# Altium project neuro_module.PrjPcb (part 1 of 2)
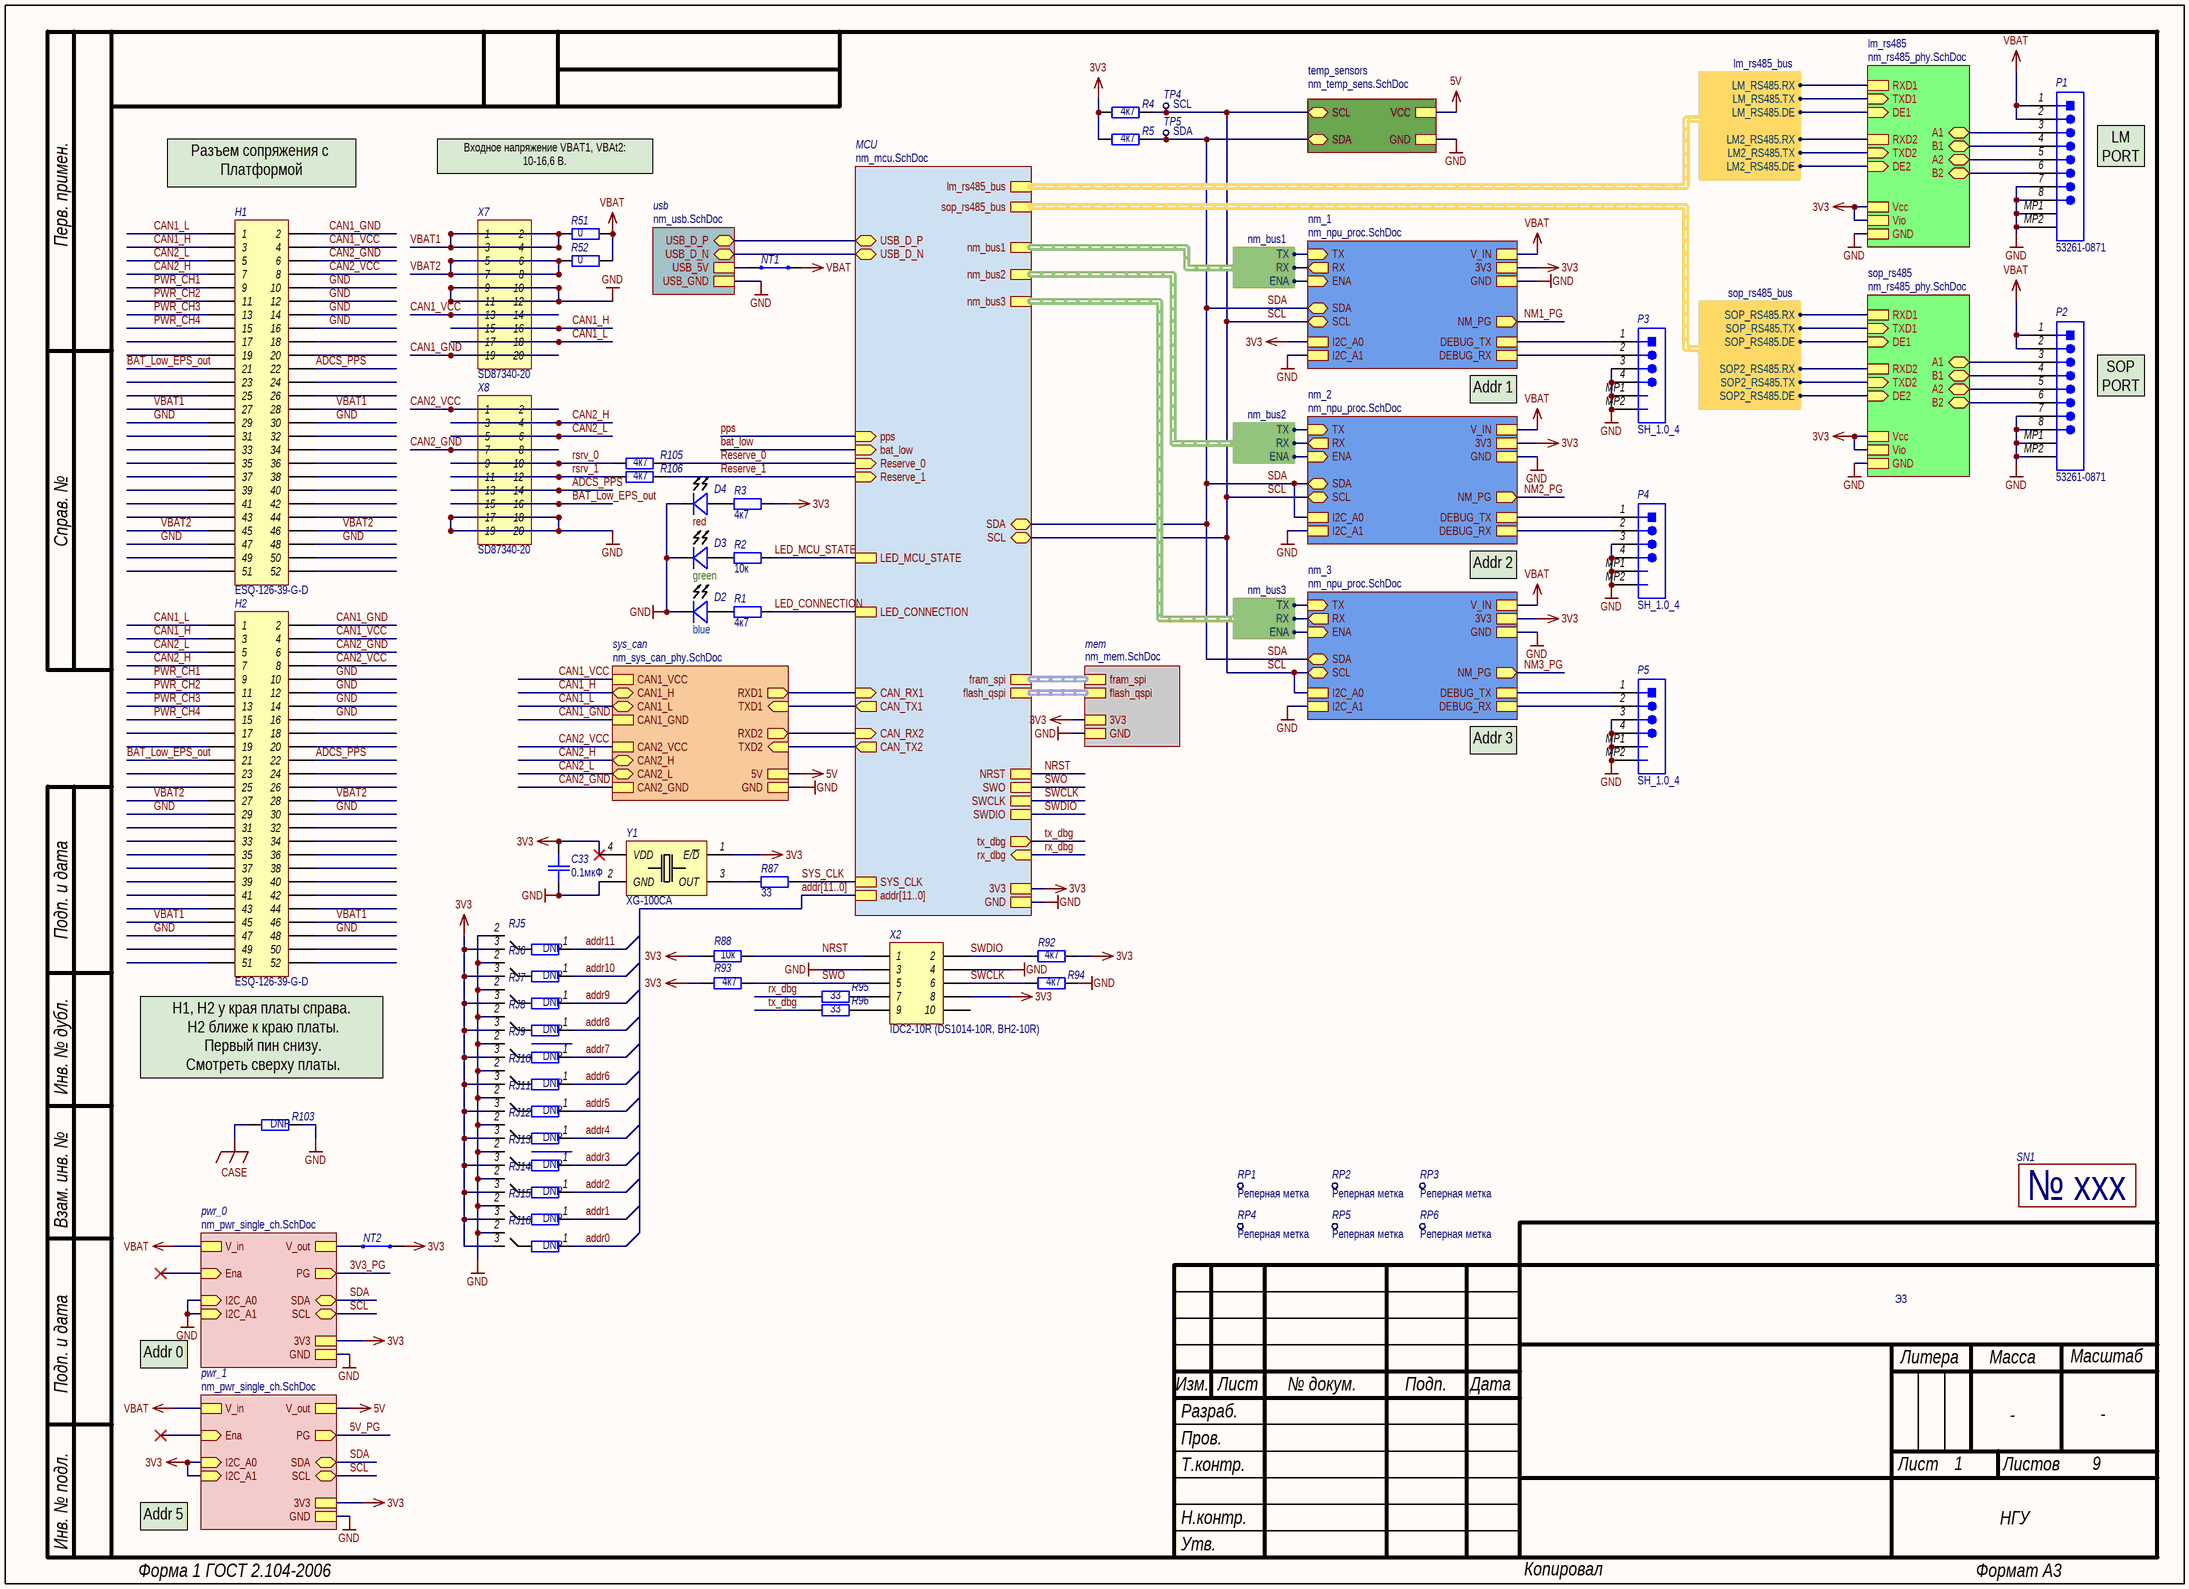
[diagram p0: nm_main.SchDoc]
GlobalOrganizationName: НГУ; GlobalProjectRevision: v1.0
9 sheets, 471 parts. Net scope: hierarchical (ports join the sheet entries above them; power ports are global).
Board file: neuro_module.PcbDoc
Sheets:
  nm_main.SchDoc
    MCU = nm_mcu.SchDoc
    usb = nm_usb.SchDoc
    pwr_0 = nm_pwr_single_ch.SchDoc
    mem = nm_mem.SchDoc
    sys_can = nm_sys_can_phy.SchDoc
    pwr_1 = nm_pwr_single_ch.SchDoc
    nm_3 = nm_npu_proc.SchDoc
      nm_pwr = nm_pwr_single_ch.SchDoc
    lm_rs485 = nm_rs485_phy.SchDoc
    nm_2 = nm_npu_proc.SchDoc
      nm_pwr = nm_pwr_single_ch.SchDoc
    nm_1 = nm_npu_proc.SchDoc
      nm_pwr = nm_pwr_single_ch.SchDoc
    sop_rs485 = nm_rs485_phy.SchDoc
    temp_sensors = nm_temp_sens.SchDoc

## Sheet nm_main.SchDoc: =GlobalProjectName
size 410 x 297 mm; Organization: НГУ; DocumentNumber: Э3; Revision: v1.0; SheetNumber: 1; SheetTotal: 9; PageSetup: Record=PageOptions|CenterHorizontal=True|CenterVertical=True|PrintScale=1.00|XCorrection=1.00|YCorrection=1.00|PrintKind=1|BorderSize=5000000|LeftOffset=0|BottomOffset=0|Orientation=2|PaperLength=1000|PaperWidth=1000|Scale=100|PaperSource=15|PrintQuality=1200|MediaType=1|DitherType=10|PaperKind=A3|PrintScaleMode=1; Weight: -; ScaleFactor: -

### Parts
C33  0.1мкФ  [SMD_C0603]
D2  value blue  [LED_0603]  (hidden comment: LED)
D3  value green  [LED_0603]  (hidden comment: LED)
D4  value red  [LED_0603]  (hidden comment: LED)
H1  ESQ-126-39-G-D  [ESQ-126-39-G-D]
H2  ESQ-126-39-G-D  [ESQ-126-39-G-D]
NT1  OSM R1-8  [NetTie_1mm]  (value not drawn)  (net tie, no BOM)
NT2  OSM R1-8  [NetTie_1mm]  (value not drawn)  (net tie, no BOM)
P1  53261-0871  [53261-0871]
P2  53261-0871  [53261-0871]
P3  SH_1.0_4  [53261-0471]
P4  SH_1.0_4  [53261-0471]
P5  SH_1.0_4  [53261-0471]
R1  4к7  [SMD_0603]
R2  10к  [SMD_0603]
R3  4к7  [SMD_0603]
R4  4к7  [SMD_0603]
R5  4к7  [SMD_0603]
R51  0  [SMD_1206]
R52  0  [SMD_1206]
R87  33  [SMD_0603]
R88  value 10к  [SMD_0603]  (hidden comment: Resistor)
R92  4к7  [SMD_0603]
R93  4к7  [SMD_0603]
R94  4к7  [SMD_0603]
R95  33  [SMD_0603]
R96  33  [SMD_0603]
R103  DNP  [SMD_0805]
R105  4к7  [SMD_0603]
R106  4к7  [SMD_0603]
RJ5  value DNP  [SMD_JMP_0402]  (hidden comment: OSM R1-8)
RJ6  value DNP  [SMD_JMP_0402]  (hidden comment: OSM R1-8)
RJ7  value DNP  [SMD_JMP_0402]  (hidden comment: OSM R1-8)
RJ8  value DNP  [SMD_JMP_0402]  (hidden comment: OSM R1-8)
RJ9  value DNP  [SMD_JMP_0402]  (hidden comment: OSM R1-8)
RJ10  value DNP  [SMD_JMP_0402]  (hidden comment: OSM R1-8)
RJ11  value DNP  [SMD_JMP_0402]  (hidden comment: OSM R1-8)
RJ12  value DNP  [SMD_JMP_0402]  (hidden comment: OSM R1-8)
RJ13  value DNP  [SMD_JMP_0402]  (hidden comment: OSM R1-8)
RJ14  value DNP  [SMD_JMP_0402]  (hidden comment: OSM R1-8)
RJ15  value DNP  [SMD_JMP_0402]  (hidden comment: OSM R1-8)
RJ16  value DNP  [SMD_JMP_0402]  (hidden comment: OSM R1-8)
RP1  Наименование: Реперная метка  [ReperPoint]  (hidden comment: RP)  (no BOM)
RP2  Наименование: Реперная метка  [ReperPoint]  (hidden comment: RP)  (no BOM)
RP3  Наименование: Реперная метка  [ReperPoint]  (hidden comment: RP)  (no BOM)
RP4  Наименование: Реперная метка  [ReperPoint]  (hidden comment: RP)  (no BOM)
RP5  Наименование: Реперная метка  [ReperPoint]  (hidden comment: RP)  (no BOM)
RP6  Наименование: Реперная метка  [ReperPoint]  (hidden comment: RP)  (no BOM)
SN1  Место под нанесение серийного номера  [Serial_number_v2]  (value not drawn)  (graphical)
TP4  SCL  [TP_PAD_1]  (no BOM)
TP5  SDA  [TP_PAD_1]  (no BOM)
X2  Наименование: IDC2-10R (DS1014-10R, BH2-10R)  [IDC2-10R]  (hidden comment: Header 2X10)
X7  Наименование: SD87340-20  [PLD2-20_SD87340-20]  (hidden comment: Header 2X20)
X8  Наименование: SD87340-20  [PLD2-20_SD87340-20]  (hidden comment: Header 2X20)
Y1  Наименование: XG-100CA  [SMD_7050_Crystal_Oscillator]  (hidden comment: XG-1000CA)

### Sub-sheets
lm_rs485 = nm_rs485_phy.SchDoc: A1 (bidir), RXD1, TXD1 (in), DE1 (in), B1 (bidir), A2 (bidir), RXD2, TXD2 (in), DE2 (in), B2 (bidir), Vcc, Vio, GND
MCU = nm_mcu.SchDoc: SDA (bidir), SCL (bidir), USB_D_P (bidir), USB_D_N (bidir), pps (in), LED_MCU_STATE, LED_CONNECTION, bat_low (in), CAN_TX2 (out), CAN_RX2 (in), CAN_TX1 (out), CAN_RX1 (in), SYS_CLK, NRST, tx_dbg (out), SWO, rx_dbg (in), SWCLK, GND, SWDIO, 3V3, fram_spi, flash_qspi, Reserve_0 (in), Reserve_1 (in), addr[11..0], nm_bus1 (harness nm_bus1), nm_bus2 (harness nm_bus2), nm_bus3 (harness nm_bus3), lm_rs485_bus (harness lm_rs485_bus), sop_rs485_bus (harness sop_rs485_bus)
mem = nm_mem.SchDoc: 3V3, GND, fram_spi (harness fram_spi), flash_qspi (harness flash_qspi)
nm_1 = nm_npu_proc.SchDoc: GND, V_IN, TX (in), RX (out), 3V3, ENA (in), I2C_A0, I2C_A1, SCL (bidir), SDA (bidir), NM_PG (out), DEBUG_TX, DEBUG_RX
nm_2 = nm_npu_proc.SchDoc: GND, V_IN, TX (in), RX (out), 3V3, ENA (in), I2C_A0, I2C_A1, SCL (bidir), SDA (bidir), NM_PG (out), DEBUG_TX, DEBUG_RX
nm_3 = nm_npu_proc.SchDoc: GND, V_IN, TX (in), RX (out), DEBUG_TX, DEBUG_RX, 3V3, ENA (in), I2C_A0, I2C_A1, SCL (bidir), SDA (bidir), NM_PG (out)
pwr_0 = nm_pwr_single_ch.SchDoc: Ena (in), V_in, PG (out), GND, V_out, SCL (bidir), SDA (bidir), I2C_A0 (in), I2C_A1 (in), 3V3  | TP_STR: 3V3; R1_Value: 150к; R2_Value: 47к; R_efuse1_mid: 120к; R_efuse1_bot: 43к; R_efuse1_ilim: 3к3; R_pwr_led: 4к7; R_efuse2_bot: 270к; R_efuse1_top: 470к; R_efuse2_mid: 91к; R_efuse2_ilim: 1к1; R_efuse2_top: 470к; C_efuse2_dVdT: 10нФ; C_efuse2_itimer: 2.4нФ
pwr_1 = nm_pwr_single_ch.SchDoc: Ena (in), V_in, PG (out), GND, V_out, SCL (bidir), SDA (bidir), I2C_A0 (in), I2C_A1 (in), 3V3  | TP_STR: 5V0; R1_Value: 160к; R2_Value: 30к; R_efuse1_mid: 120к; R_efuse1_bot: 43к; R_efuse1_ilim: 3к3; R_pwr_led: 4к7; R_efuse2_bot: 130к; R_efuse2_mid: 62к; R_efuse2_ilim: 3к3; R_efuse1_top: 470к; R_efuse2_top: 470к; C_efuse2_dVdT: 10нФ; C_efuse2_itimer: 2.4нФ
sop_rs485 = nm_rs485_phy.SchDoc: A1 (bidir), RXD1, TXD1 (in), DE1 (in), B1 (bidir), A2 (bidir), RXD2, TXD2 (in), DE2 (in), B2 (bidir), Vcc, Vio, GND
sys_can = nm_sys_can_phy.SchDoc: CAN1_GND, CAN2_H (bidir), CAN2_L (bidir), TXD2 (in), CAN2_GND, CAN1_H (bidir), RXD2 (out), TXD1 (in), CAN2_VCC, CAN1_L (bidir), RXD1 (out), CAN1_VCC, 5V, GND
temp_sensors = nm_temp_sens.SchDoc: VCC, GND, SDA (bidir), SCL (bidir)
usb = nm_usb.SchDoc: USB_D_P (bidir), USB_D_N (bidir), USB_5V, USB_GND

### Harnesses
nm_bus1: TX, RX, ENA
nm_bus2: TX, RX, ENA
nm_bus3: TX, RX, ENA
lm_rs485_bus: LM_RS485.RX, LM_RS485.TX, LM_RS485.DE, LM2_RS485.RX, LM2_RS485.TX, LM2_RS485.DE
sop_rs485_bus: SOP_RS485.RX, SOP_RS485.TX, SOP_RS485.DE, SOP2_RS485.RX, SOP2_RS485.TX, SOP2_RS485.DE

### Nets
3V3: C33.2 NT2.2 R3.1 R4.2 R5.2 R88.1 R92.2 R93.2 RJ5.3 RJ6.3 RJ7.3 RJ8.3 RJ9.3 RJ10.3 RJ11.3 RJ12.3 RJ13.3 RJ14.3 RJ15.3 RJ16.3 X2.8 Y1.1(E/~{D}) Y1.4(VDD) ; sheet MCU/3V3, sheet pwr_0/3V3, sheet mem/3V3, sheet sys_can/5V, sheet pwr_1/V_out, sheet pwr_1/I2C_A0, sheet pwr_1/I2C_A1, sheet pwr_1/3V3, sheet nm_3/3V3, sheet lm_rs485/Vcc, sheet lm_rs485/Vio, sheet nm_2/3V3, sheet nm_1/3V3, sheet nm_1/I2C_A0, sheet sop_rs485/Vcc, sheet sop_rs485/Vio, sheet temp_sensors/VCC  [also labelled 5V]
CAN1_GND: H1.2 H2.2 X7.19 X7.20 ; sheet sys_can/CAN1_GND
CAN1_VCC: H1.4 H2.4 X7.13 X7.14 ; sheet sys_can/CAN1_VCC
CAN2_GND: H1.6 H2.6 X8.7 X8.8 ; sheet sys_can/CAN2_GND
CAN2_VCC: H1.8 H2.8 X8.1 X8.2 ; sheet sys_can/CAN2_VCC
CASE: R103.2
GND: C33.1 D2.2(K) D3.2(K) D4.2(K) H1.10 H1.12 H1.14 H1.16 H1.29 H1.30 H1.47 H1.48 H2.10 H2.12 H2.14 H2.16 H2.29 H2.30 H2.47 H2.48 P1.7 P1.8 P1.MP1 P1.MP2 P2.7 P2.8 P2.MP1 P2.MP2 P3.3 P3.4 P3.MP1 P3.MP2 P4.3 P4.4 P4.MP1 P4.MP2 P5.3 P5.4 P5.MP1 P5.MP2 R94.1 R103.1 RJ5.2 RJ6.2 RJ7.2 RJ8.2 RJ9.2 RJ10.2 RJ11.2 RJ12.2 RJ13.2 RJ14.2 RJ15.2 RJ16.2 X2.3 X2.4 X7.9 X7.10 X7.11 X7.12 X8.17 X8.18 X8.19 X8.20 Y1.2(GND) ; sheet MCU/GND, sheet usb/USB_GND, sheet pwr_0/GND, sheet pwr_0/I2C_A0, sheet pwr_0/I2C_A1, sheet mem/GND, sheet sys_can/GND, sheet pwr_1/GND, sheet nm_3/GND, sheet nm_3/I2C_A1, sheet lm_rs485/GND, sheet nm_2/GND, sheet nm_2/I2C_A1, sheet nm_1/GND, sheet nm_1/I2C_A1, sheet sop_rs485/GND, sheet temp_sensors/GND
VBAT: NT1.2 P1.1 P1.2 P2.1 P2.2 R51.2 R52.2 ; sheet pwr_0/V_in, sheet pwr_1/V_in, sheet nm_3/V_IN, sheet nm_2/V_IN, sheet nm_1/V_IN
A1: P2.3 ; sheet sop_rs485/A1
A1: P1.3 ; sheet lm_rs485/A1  [a separate net that carries the same name]
A2: P2.5 ; sheet sop_rs485/A2
A2: P1.5 ; sheet lm_rs485/A2  [a separate net that carries the same name]
ADCS_PPS: H1.22 H2.22 X8.13 X8.14
addr0: RJ16.1
addr1: RJ15.1
addr2: RJ14.1
addr3: RJ13.1
addr4: RJ12.1
addr5: RJ11.1
addr6: RJ10.1
addr7: RJ9.1
addr8: RJ8.1
addr9: RJ7.1
addr10: RJ6.1
addr11: RJ5.1
B1: P2.4 ; sheet sop_rs485/B1
B1: P1.4 ; sheet lm_rs485/B1  [a separate net that carries the same name]
B2: P2.6 ; sheet sop_rs485/B2
B2: P1.6 ; sheet lm_rs485/B2  [a separate net that carries the same name]
BAT_Low_EPS_out: H1.21 H2.21 X8.15 X8.16
CAN1_H: H1.3 H2.3 X7.15 X7.16 ; sheet sys_can/CAN1_H
CAN1_L: H1.1 H2.1 X7.17 X7.18 ; sheet sys_can/CAN1_L
CAN2_H: H1.7 H2.7 X8.3 X8.4 ; sheet sys_can/CAN2_H
CAN2_L: H1.5 H2.5 X8.5 X8.6 ; sheet sys_can/CAN2_L
CAN_RX1: sheet MCU/CAN_RX1, sheet sys_can/RXD1
CAN_RX2: sheet MCU/CAN_RX2, sheet sys_can/RXD2
CAN_TX1: sheet MCU/CAN_TX1, sheet sys_can/TXD1
CAN_TX2: sheet MCU/CAN_TX2, sheet sys_can/TXD2
DEBUG_RX: P3.2 ; sheet nm_1/DEBUG_RX
DEBUG_RX: P4.2 ; sheet nm_2/DEBUG_RX  [a separate net that carries the same name]
DEBUG_RX: P5.2 ; sheet nm_3/DEBUG_RX  [a separate net that carries the same name]
DEBUG_TX: P3.1 ; sheet nm_1/DEBUG_TX
DEBUG_TX: P4.1 ; sheet nm_2/DEBUG_TX  [a separate net that carries the same name]
DEBUG_TX: P5.1 ; sheet nm_3/DEBUG_TX  [a separate net that carries the same name]
LED_CONNECTION: R1.1 ; sheet MCU/LED_CONNECTION
LED_MCU_STATE: R2.1 ; sheet MCU/LED_MCU_STATE
lm2_rs485.DE: sheet lm_rs485/DE2, sheet MCU/lm_rs485_bus.LM2_RS485.DE
lm2_rs485.RX: sheet lm_rs485/RXD2, sheet MCU/lm_rs485_bus.LM2_RS485.RX
lm2_rs485.TX: sheet lm_rs485/TXD2, sheet MCU/lm_rs485_bus.LM2_RS485.TX
lm_rs485.DE: sheet lm_rs485/DE1, sheet MCU/lm_rs485_bus.LM_RS485.DE
lm_rs485.RX: sheet lm_rs485/RXD1, sheet MCU/lm_rs485_bus.LM_RS485.RX
lm_rs485.TX: sheet lm_rs485/TXD1, sheet MCU/lm_rs485_bus.LM_RS485.TX
nm_bus1.Ena: sheet nm_1/ENA, sheet MCU/nm_bus1.ENA
nm_bus1.RX: sheet nm_1/RX, sheet MCU/nm_bus1.RX
nm_bus1.TX: sheet nm_1/TX, sheet MCU/nm_bus1.TX
nm_bus2.Ena: sheet nm_2/ENA, sheet MCU/nm_bus2.ENA
nm_bus2.RX: sheet nm_2/RX, sheet MCU/nm_bus2.RX
nm_bus2.TX: sheet nm_2/TX, sheet MCU/nm_bus2.TX
nm_bus3.Ena: sheet nm_3/ENA, sheet MCU/nm_bus3.ENA
nm_bus3.RX: sheet nm_3/RX, sheet MCU/nm_bus3.RX
nm_bus3.TX: sheet nm_3/TX, sheet MCU/nm_bus3.TX
NRST: R88.2 X2.1 ; sheet MCU/NRST
PWR_CH1: H1.9 H2.9
PWR_CH2: H1.11 H2.11
PWR_CH3: H1.13 H2.13
PWR_CH4: H1.15 H2.15
Reserve_0: R105.1 ; sheet MCU/Reserve_0
Reserve_1: R106.1 ; sheet MCU/Reserve_1
rsrv_0: R105.2 X8.9 X8.10
rsrv_1: R106.2 X8.11 X8.12
rx_dbg: R95.1 ; sheet MCU/rx_dbg
SCL: R4.1 TP4.0(TP) ; sheet MCU/SCL, sheet pwr_0/SCL, sheet pwr_1/SCL, sheet nm_3/I2C_A0, sheet nm_3/SCL, sheet nm_2/SCL, sheet nm_1/SCL, sheet temp_sensors/SCL
SDA: R5.1 TP5.0(TP) ; sheet MCU/SDA, sheet pwr_0/SDA, sheet pwr_1/SDA, sheet nm_3/SDA, sheet nm_2/I2C_A0, sheet nm_2/SDA, sheet nm_1/SDA, sheet temp_sensors/SDA
sop2_rs485.DE: sheet sop_rs485/DE2, sheet MCU/sop_rs485_bus.SOP2_RS485.DE
sop2_rs485.RX: sheet sop_rs485/RXD2, sheet MCU/sop_rs485_bus.SOP2_RS485.RX
sop2_rs485.TX: sheet sop_rs485/TXD2, sheet MCU/sop_rs485_bus.SOP2_RS485.TX
sop_rs485.DE: sheet sop_rs485/DE1, sheet MCU/sop_rs485_bus.SOP_RS485.DE
sop_rs485.RX: sheet sop_rs485/RXD1, sheet MCU/sop_rs485_bus.SOP_RS485.RX
sop_rs485.TX: sheet sop_rs485/TXD1, sheet MCU/sop_rs485_bus.SOP_RS485.TX
SWCLK: R94.2 X2.6 ; sheet MCU/SWCLK
SWDIO: R92.1 X2.2 ; sheet MCU/SWDIO
SWO: R93.1 X2.5 ; sheet MCU/SWO
SYS_CLK: R87.2 ; sheet MCU/SYS_CLK
tx_dbg: R96.1 ; sheet MCU/tx_dbg
USB_5V: NT1.1 ; sheet usb/USB_5V
USB_D_N: sheet MCU/USB_D_N, sheet usb/USB_D_N
USB_D_P: sheet MCU/USB_D_P, sheet usb/USB_D_P
V_out: NT2.1 ; sheet pwr_0/V_out
VBAT1: H1.27 H1.28 H2.45 H2.46 R51.1 X7.1 X7.2 X7.3 X7.4
VBAT2: H1.45 H1.46 H2.27 H2.28 R52.1 X7.5 X7.6 X7.7 X7.8
NetD2_1: D2.1(A) R1.2
NetD3_1: D3.1(A) R2.2
NetD4_1: D4.1(A) R3.2
NetR87_1: R87.1 Y1.3(OUT)
NetR95_2: R95.2 X2.7
NetR96_2: R96.2 X2.9

Not connected (* = marked no-connect by the designer): H1 17 18 19 20 23 24 25 26 31 32 33 34 35 36 37 38 39 40 41 42 43 44 49 50 51 52; H2 17 18 19 20 23 24 25 26 31 32 33 34 35 36 37 38 39 40 41 42 43 44 49 50 51 52; X2 10

### Buses and harness runs
bus addr[11..0] = sheet MCU/addr[11..0]
harness sheet MCU/flash_qspi = sheet mem/flash_qspi
harness sheet MCU/fram_spi = sheet mem/fram_spi

### Notes on the sheet
- (near H1) Разъем сопряжения с
  Платформой
- Входное напряжение VBAT1, VBAt2:
  10-16,6 В.
- (near P1) LM PORT
- Addr 1
- (near P2) SOP
  PORT
- Addr 2
- Addr 3
- H1, H2 у края платы справа.
  H2 ближе к краю платы.
  Первый пин снизу.
  Смотреть сверху платы.
- Addr 0
- Addr 5
- Перв. примен.
- Справ. №
- Подп. и дата
- Инв. № дубл.
- Взам. инв. №
- Э3
- Изм.
- Разраб.
- Лист
- № докум.
- Подп.
- Дата
- Литера
- Масса
- Масштаб
- Пров.
- Т.контр.
- Листов
- Н.контр.
- Утв.
- Инв. № подл.
- Форма 1 ГОСТ 2.104-2006
- Копировал
- Формат А3
- (in symbol Serial_number) № xxx

### Library data of the parts
C33 = Capacitor: Назначение: SMD-конденсатор; Наименование: Конденсатор; Потребление, Вт: 0; Точность: %; Напряжение: В; Value: 0.1мкФ; Диэлектрик: *; Place_v1: *; Place_v2: *
D2-D4 = LED: Назначение: Светодиод; Наименование: SMD-LED; Потребление, Вт: 0,01; Place_v1: *; Place_v2: *
H1 H2 = ESQ-126-39-G-D: Elevated socket, dual-row, 26-pin per row; Назначение: Сквозной разъем, двойно, 52 контакта, шаг 2,54 мм; Потребление, Вт: 0,00; Place_v2: DNP; ComponentLink1Description: DataSheet; ComponentLink1URL: https://static.chipdip.ru/lib/071/DOC025071643.pdf; Наименование: ESQ-126-39-G-D
NT1 NT2 = NetTie: Different Nets connection; Потребление, Вт: 0,001; Value: 0; Наименование: NetTie; Назначение: NetTie; Place_v1: *; Place_v2: *
P1 P2 = PicoBlade_53261-0871: Male Header, Pitch 1.25 mm, 1 x 8 Position, Height 3.4 mm, -40 to 85 degC, RoHS, Tape and Reel; Потребление, Вт: 0.0; Назначение: Male Header, Pitch 1.25 mm, 1 x 8 Position, Height 3.4 mm, -40 to 85 degC, RoHS, Tape and Reel; ComponentLink1Description: DataSheet; ComponentLink1URL: http://www.molex.com/pdm_docs/sd/532610671_sd.pdf; Наименование: 53261-0871
P3-P5 = SH_1.0_4: JST SH1.0, 1.0 mm pitch/Disconnactable crimp style connectors; Потребление, Вт: 0.0; Назначение: JST SH1.0, 1.0 mm pitch/Disconnactable crimp style connectors; ComponentLink1Description: DataSheet; ComponentLink1URL: https://www.jst-mfg.com/product/pdf/eng/eSH.pdf; Наименование: SH_1.0_4
R1-R3 R87 R95 R96 R105 R106 = Resistor: Наименование: Резистор; Назначение: SMD-резистор; Потребление, Вт: 0,001
  R1 R3: Value: 4к7; Place_v1: *; Place_v2: *
  R2: Value: 10к; Place_v1: *; Place_v2: *
  R87 R95 R96: Value: 33; Place_v1: *; Place_v2: *
  R105 R106: Value: 4к7
R4 R5 R92-R94 R103 = Resistor: Наименование: Резистор; Назначение: SMD-резистор; Потребление, Вт: 0,001; Описание: Резистор 0603 10K ±1% 100ppm/°C; Place_v1: *; Place_v2: *
  R4 R5 R92-R94: Value: 4к7
  R103: Value: DNP
R51 = Resistor: Наименование: Резистор; Назначение: SMD-резистор; Потребление, Вт: 0,001; Place_v2: DNP; Value: 0
R52 = Resistor: Наименование: Резистор; Назначение: SMD-резистор; Потребление, Вт: 0,001; Place_v1: DNP; Value: 0
R88 = Resistor: Наименование: Резистор; Назначение: SMD-резистор; Потребление, Вт: 0,001; Точность: %; Place_v1: *; Place_v2: *
RJ5-RJ16 = Resistor_Jamper: Resistor-Jumper; Назначение: Резистор для выбора режима; Наименование: Резистор; Потребление, Вт: 0,0; Place_v1: *; Place_v2: *
RP1-RP6 = RP: Назначение: реперная метка для автоматического монтажа; Place_v1: *; Place_v2: *
SN1 = Serial_number: Потребление, Вт: 0; Назначение: Место под нанесение серийного номера; Наименование: Место под нанесение серийного номера; Place_v1: *; Place_v2: *
TP4 TP5 = TP: Наименование: Точка проверки; Назначение: Контроль параметров платы; Place_v1: *; Place_v2: *
  TP4: TP_Name: SCL
  TP5: TP_Name: SDA
X2 = Header 2X10: Header, 10-Pin, Dual row; Назначение: Header, 10-Pin, Dual row, R/A; Потребление, Вт: 0,0
X7 X8 = Header 2X20: Header, 20-Pin, Dual row; Потребление, Вт: 0,0; Place_v2: DNP; Примечание: Для монтажа из 2-х 10-pin необходимо сточить край разъема; Назначение: Header, 20-Pin, Dual row
Y1 = Crystal_Oscillator: Crystall oscillator, CMOS, 3.3V, SMD7050; Назначение: Crystall oscillator, CMOS, 3.3V, SMD7050, 10 МГц; Потребление, Вт: 0.12; ComponentLink1Description: DataSheet; ComponentLink1URL: https://ru.mouser.com/datasheet/2/137/G_1000CA_en-1003255.pdf; Place_v1: *; Place_v2: *

## Sheet nm_mcu.SchDoc: =GlobalProjectName
size 410 x 297 mm; Organization: НГУ; DocumentNumber: Э3; Revision: v1.0; SheetNumber: 2; SheetTotal: 9; PageSetup: Record=PageOptions|CenterHorizontal=True|CenterVertical=True|PrintScale=1.00|XCorrection=1.00|YCorrection=1.00|PrintKind=1|BorderSize=5000000|LeftOffset=0|BottomOffset=0|Orientation=2|PaperLength=1000|PaperWidth=1000|Scale=100|PaperSource=15|PrintQuality=1200|MediaType=1|DitherType=10|PaperKind=A3|PrintScaleMode=1; Weight: -; ScaleFactor: -
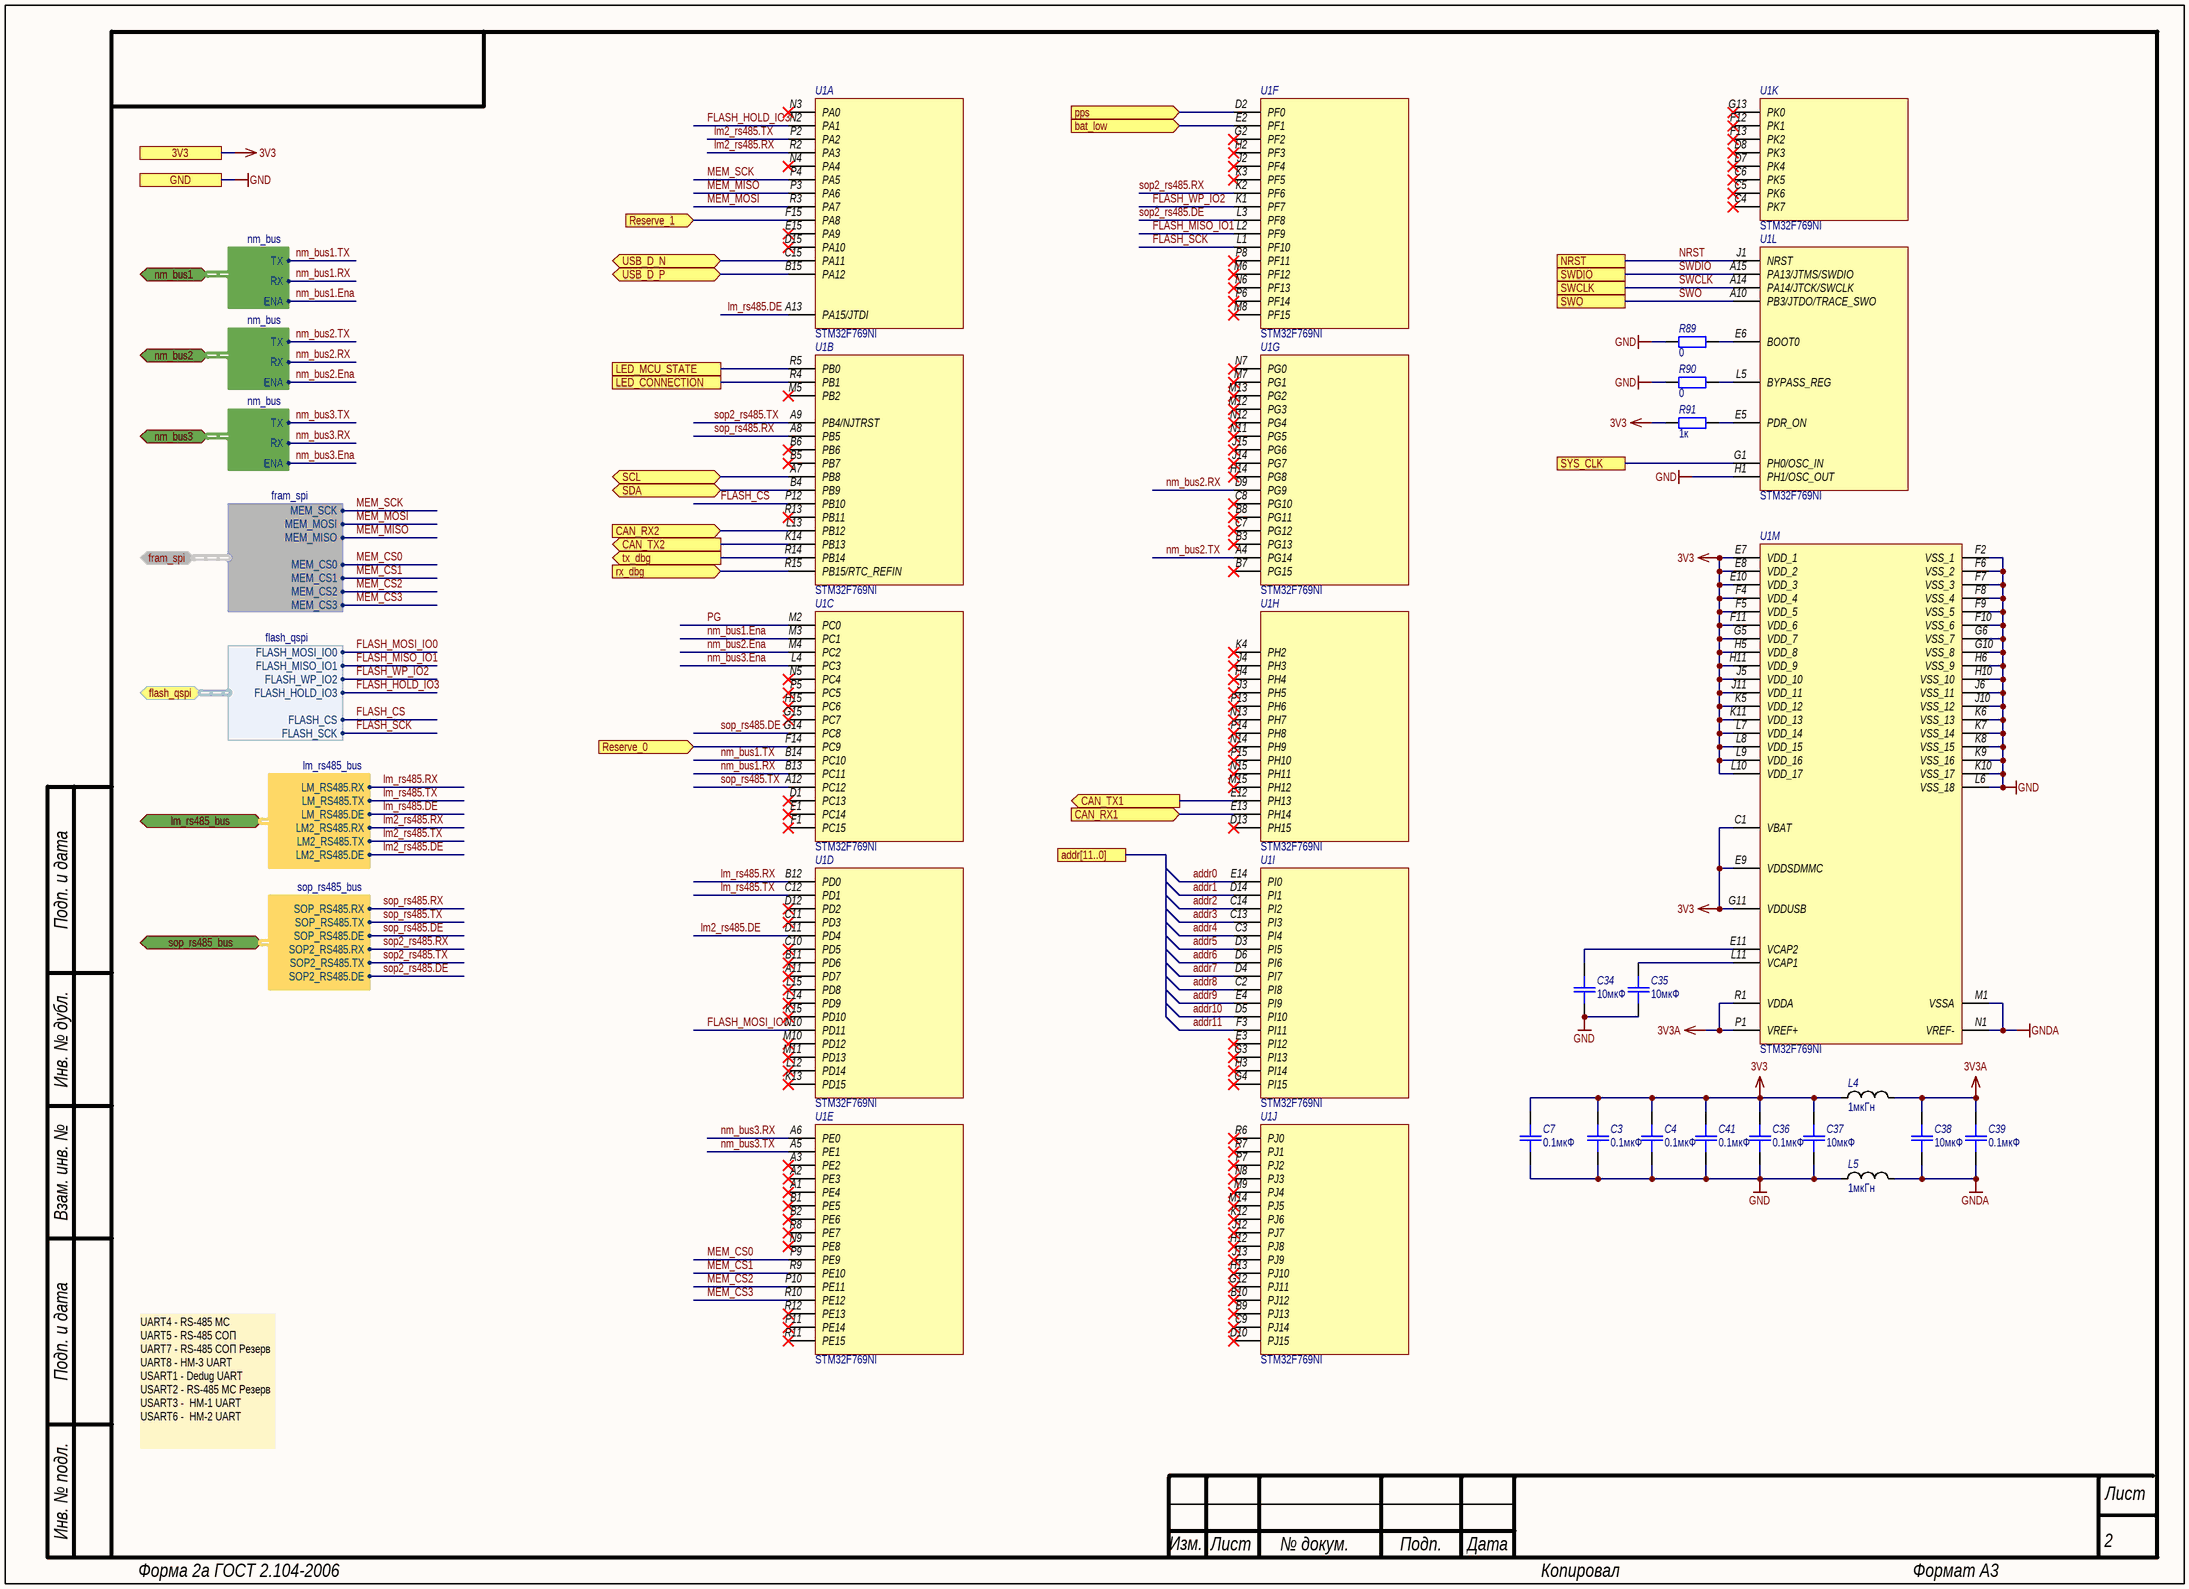
[diagram p1: nm_mcu.SchDoc]

### Parts
C3  0.1мкФ  [SMD_C0603]
C4  0.1мкФ  [SMD_C0603]
C7  0.1мкФ  [SMD_C0603]
C34  value 10мкФ  [SMD_C0603]  (hidden comment: Capacitor)
C35  value 10мкФ  [SMD_C0603]  (hidden comment: Capacitor)
C36  0.1мкФ  [SMD_C0603]
C37  10мкФ  [SMD_C0603]
C38  10мкФ  [SMD_C0603]
C39  0.1мкФ  [SMD_C0603]
C41  0.1мкФ  [SMD_C0603]
L4  1мкГн  [SMD_0805]
L5  1мкГн  [SMD_0805]
R89  value 0  [SMD_0603]  (hidden comment: Resistor)
R90  value 0  [SMD_0603]  (hidden comment: Resistor)
R91  value 1к  [SMD_0603]  (hidden comment: Resistor)
U1  STM32F769NI  [BGA216C80P15X15_1300X1300X110]  (parts A,B,C,D,E,F,G,H,I,J,K,L,M of 13)

### Ports
3V3, addr[11..0], bat_low (in), CAN_RX1 (in), CAN_RX2 (in), CAN_TX1 (out), CAN_TX2 (out), flash_qspi (bidir, harness flash_qspi), fram_spi (bidir, harness fram_spi), GND, LED_CONNECTION, LED_MCU_STATE, lm_rs485_bus (bidir, harness lm_rs485_bus), nm_bus1 (bidir, harness nm_bus), nm_bus2 (bidir, harness nm_bus), nm_bus3 (bidir, harness nm_bus), NRST, pps (in), Reserve_0 (in), Reserve_1 (in), rx_dbg (in), SCL (bidir), SDA (bidir), sop_rs485_bus (bidir, harness sop_rs485_bus), SWCLK, SWDIO, SWO, SYS_CLK, tx_dbg (out), USB_D_N (bidir), USB_D_P (bidir)

### Harnesses
fram_spi: MEM_SCK, MEM_MOSI, MEM_MISO, MEM_CS0, MEM_CS1, MEM_CS2, MEM_CS3
flash_qspi: FLASH_MOSI_IO0, FLASH_MISO_IO1, FLASH_WP_IO2, FLASH_HOLD_IO3, FLASH_CS, FLASH_SCK
nm_bus: TX, RX, ENA
lm_rs485_bus: LM_RS485.RX, LM_RS485.TX, LM_RS485.DE, LM2_RS485.RX, LM2_RS485.TX, LM2_RS485.DE
sop_rs485_bus: SOP_RS485.RX, SOP_RS485.TX, SOP_RS485.DE, SOP2_RS485.RX, SOP2_RS485.TX, SOP2_RS485.DE

### Nets
3V3: C3.2 C4.2 C7.2 C36.2 C37.2 C41.2 L4.1 R91.1 U1.C1(VBAT) U1.E7(VDD_1) U1.E8(VDD_2) U1.E9(VDDSDMMC) U1.E10(VDD_3) U1.F4(VDD_4) U1.F5(VDD_5) U1.F11(VDD_6) U1.G5(VDD_7) U1.G11(VDDUSB) U1.H5(VDD_8) U1.H11(VDD_9) U1.J5(VDD_10) U1.J11(VDD_11) U1.K5(VDD_12) U1.K11(VDD_13) U1.L7(VDD_14) U1.L8(VDD_15) U1.L9(VDD_16) U1.L10(VDD_17) ; port 3V3
3V3A: C38.2 C39.2 L4.2 U1.P1(VREF+) U1.R1(VDDA)
GND: C3.1 C4.1 C7.1 C34.1 C35.1 C36.1 C37.1 C41.1 L5.1 R89.1 R90.1 U1.F2(VSS_1) U1.F6(VSS_2) U1.F7(VSS_3) U1.F8(VSS_4) U1.F9(VSS_5) U1.F10(VSS_6) U1.G6(VSS_7) U1.G10(VSS_8) U1.H1(PH1/OSC_OUT) U1.H6(VSS_9) U1.H10(VSS_10) U1.J6(VSS_11) U1.J10(VSS_12) U1.K6(VSS_13) U1.K7(VSS_14) U1.K8(VSS_15) U1.K9(VSS_16) U1.K10(VSS_17) U1.L6(VSS_18) ; port GND
GNDA: C38.1 C39.1 L5.2 U1.M1(VSSA) U1.N1(VREF-)
addr0: U1.E14(PI0)
addr1: U1.D14(PI1)
addr2: U1.C14(PI2)
addr3: U1.C13(PI3)
addr4: U1.C3(PI4)
addr5: U1.D3(PI5)
addr6: U1.D6(PI6)
addr7: U1.D4(PI7)
addr8: U1.C2(PI8)
addr9: U1.E4(PI9)
addr10: U1.D5(PI10)
addr11: U1.F3(PI11)
bat_low: U1.E2(PF1) ; port bat_low
CAN_RX1: U1.E13(PH14) ; port CAN_RX1
CAN_RX2: U1.L13(PB12) ; port CAN_RX2
CAN_TX1: U1.E12(PH13) ; port CAN_TX1
CAN_TX2: U1.K14(PB13) ; port CAN_TX2
FLASH_CS: U1.P12(PB10) ; port flash_qspi.FLASH_CS
FLASH_HOLD_IO3: U1.N2(PA1) ; port flash_qspi.FLASH_HOLD_IO3
FLASH_MISO_IO1: U1.L2(PF9) ; port flash_qspi.FLASH_MISO_IO1
FLASH_MOSI_IO0: U1.N10(PD11) ; port flash_qspi.FLASH_MOSI_IO0
FLASH_SCK: U1.L1(PF10) ; port flash_qspi.FLASH_SCK
FLASH_WP_IO2: U1.K1(PF7) ; port flash_qspi.FLASH_WP_IO2
LED_CONNECTION: U1.R4(PB1) ; port LED_CONNECTION
LED_MCU_STATE: U1.R5(PB0) ; port LED_MCU_STATE
lm2_rs485.DE: U1.D11(PD4) ; port lm_rs485_bus.LM2_RS485.DE
lm2_rs485.RX: U1.R2(PA3) ; port lm_rs485_bus.LM2_RS485.RX
lm2_rs485.TX: U1.P2(PA2) ; port lm_rs485_bus.LM2_RS485.TX
lm_rs485.DE: U1.A13(PA15/JTDI) ; port lm_rs485_bus.LM_RS485.DE
lm_rs485.RX: U1.B12(PD0) ; port lm_rs485_bus.LM_RS485.RX
lm_rs485.TX: U1.C12(PD1) ; port lm_rs485_bus.LM_RS485.TX
MEM_CS0: U1.P9(PE9) ; port fram_spi.MEM_CS0
MEM_CS1: U1.R9(PE10) ; port fram_spi.MEM_CS1
MEM_CS2: U1.P10(PE11) ; port fram_spi.MEM_CS2
MEM_CS3: U1.R10(PE12) ; port fram_spi.MEM_CS3
MEM_MISO: U1.P3(PA6) ; port fram_spi.MEM_MISO
MEM_MOSI: U1.R3(PA7) ; port fram_spi.MEM_MOSI
MEM_SCK: U1.P4(PA5) ; port fram_spi.MEM_SCK
nm_bus1.Ena: U1.M3(PC1) ; port nm_bus1.ENA
nm_bus1.RX: U1.B13(PC11) ; port nm_bus1.RX
nm_bus1.TX: U1.B14(PC10) ; port nm_bus1.TX
nm_bus2.Ena: U1.M4(PC2) ; port nm_bus2.ENA
nm_bus2.RX: U1.D9(PG9) ; port nm_bus2.RX
nm_bus2.TX: U1.A4(PG14) ; port nm_bus2.TX
nm_bus3.Ena: U1.L4(PC3) ; port nm_bus3.ENA
nm_bus3.RX: U1.A6(PE0) ; port nm_bus3.RX
nm_bus3.TX: U1.A5(PE1) ; port nm_bus3.TX
NRST: U1.J1(NRST) ; port NRST
PG: U1.M2(PC0)
pps: U1.D2(PF0) ; port pps
Reserve_0: U1.F14(PC9) ; port Reserve_0
Reserve_1: U1.F15(PA8) ; port Reserve_1
rx_dbg: U1.R15(PB15/RTC_REFIN) ; port rx_dbg
SCL: U1.A7(PB8) ; port SCL
SDA: U1.B4(PB9) ; port SDA
sop2_rs485.DE: U1.L3(PF8) ; port sop_rs485_bus.SOP2_RS485.DE
sop2_rs485.RX: U1.K2(PF6) ; port sop_rs485_bus.SOP2_RS485.RX
sop2_rs485.TX: U1.A9(PB4/NJTRST) ; port sop_rs485_bus.SOP2_RS485.TX
sop_rs485.DE: U1.G14(PC8) ; port sop_rs485_bus.SOP_RS485.DE
sop_rs485.RX: U1.A8(PB5) ; port sop_rs485_bus.SOP_RS485.RX
sop_rs485.TX: U1.A12(PC12) ; port sop_rs485_bus.SOP_RS485.TX
SWCLK: U1.A14(PA14/JTCK/SWCLK) ; port SWCLK
SWDIO: U1.A15(PA13/JTMS/SWDIO) ; port SWDIO
SWO: U1.A10(PB3/JTDO/TRACE_SWO) ; port SWO
SYS_CLK: U1.G1(PH0/OSC_IN) ; port SYS_CLK
tx_dbg: U1.R14(PB14) ; port tx_dbg
USB_D_N: U1.C15(PA11) ; port USB_D_N
USB_D_P: U1.B15(PA12) ; port USB_D_P
NetC34_2: C34.2 U1.E11(VCAP2)
NetC35_2: C35.2 U1.L11(VCAP1)
NetR89_2: R89.2 U1.E6(BOOT0)
NetR90_2: R90.2 U1.L5(BYPASS_REG)
NetR91_2: R91.2 U1.E5(PDR_ON)

Not connected (* = marked no-connect by the designer): U1 A1(PE4)* A2(PE3)* A3(PE2)* A11(PD7)* B1(PE5)* B2(PE6)* B3(PG13)* B5(PB7)* B6(PB6)* B7(PG15)* B8(PG11)* B9(PJ13)* B10(PJ12)* B11(PD6)* C4(PK7)* C5(PK6)* C6(PK5)* C7(PG12)* C8(PG10)* C9(PJ14)* C10(PD5)* C11(PD3)* D1(PC13)* D7(PK4)* D8(PK3)* D10(PJ15)* D12(PD2)* D13(PH15)* D15(PA10)* E1(PC14)* E3(PI12)* E15(PA9)* F1(PC15)* F12(PK1)* F13(PK2)* G2(PF2)* G3(PI13)* G4(PI15)* G12(PJ11)* G13(PK0)* G15(PC7)* H2(PF3)* H3(PI14)* H4(PH4)* H12(PJ8)* H13(PJ10)* H14(PG8)* H15(PC6)* J2(PF4)* J3(PH5)* J4(PH3)* J12(PJ7)* J13(PJ9)* J14(PG7)* J15(PG6)* K3(PF5)* K4(PH2)* K12(PJ6)* K13(PD15)* K15(PD10)* L12(PD14)* L14(PD9)* L15(PD8)* M5(PB2)* M6(PF12)* M7(PG1)* M8(PF15)* M9(PJ4)* M10(PD12)* M11(PD13)* M12(PG3)* M13(PG2)* M14(PJ5)* M15(PH12)* N3(PA0)* N4(PA4)* N5(PC4)* N6(PF13)* N7(PG0)* N8(PJ3)* N9(PE8)* N11(PG5)* N12(PG4)* N13(PH7)* N14(PH9)* N15(PH11)* P5(PC5)* P6(PF14)* P7(PJ2)* P8(PF11)* P11(PE14)* P13(PH6)* P14(PH8)* P15(PH10)* R6(PJ0)* R7(PJ1)* R8(PE7)* R11(PE15)* R12(PE13)* R13(PB11)*

### Notes on the sheet
- UART4 - RS-485 МС
  UART5 - RS-485 СОП
  UART7 - RS-485 СОП Резерв
  UART8 - НМ-3 UART
  USART1 - Dedug UART
  USART2 - RS-485 МС Резерв
  USART3 -  НМ-1 UART
  USART6 -  НМ-2 UART
- Подп. и дата
- Инв. № дубл.
- Взам. инв. №
- Инв. № подл.
- Изм.
- Лист
- № докум.
- Подп.
- Дата
- Форма 2а ГОСТ 2.104-2006
- Копировал
- Формат А3

### Library data of the parts
C3 C4 C7 C36-C39 C41 = Capacitor: Назначение: SMD-конденсатор; Наименование: Конденсатор; Потребление, Вт: 0; Place_v1: *; Place_v2: *
  C3 C4 C7 C36 C39 C41: Value: 0.1мкФ
  C37 C38: Value: 10мкФ
C34 C35 = Capacitor: as C33 on sheet nm_main; Диэлектрик: *; Place_v1: *; Place_v2: *
L4 L5 = Inductor: Наименование: Индуктивность; Назначение: SMD-индуктивность; Потребление, Вт: 0,010; Value: 1мкГн; Place_v1: *; Place_v2: *
R89-R91 = Resistor: as R88 on sheet nm_main; Place_v1: *; Place_v2: *
U1 = STM32F769NI: High-performance and DSP with FPU, Arm Cortex-M7 MCU with 2 Mbytes of Flash memory, 216 MHz CPU, Art Accelerator, L1 cache, SDRAM, TFT, MIPI-DSI, JPEG codec, DFSDM; Потребление, Вт: 0.01; Назначение: Arm Cortex-M7 MCU; ComponentLink1Description: DataSheet; ComponentLink1URL: https://www.st.com/resource/en/datasheet/stm32f769ni.pdf; Наименование: STM32F769NI

## Sheet nm_usb.SchDoc: =GlobalProjectName
size 209 x 297 mm; Organization: НГУ; DocumentNumber: Э3; Revision: v1.0; SheetNumber: 6; SheetTotal: 9; PageSetup: Record=PageOptions|CenterHorizontal=True|CenterVertical=True|PrintScale=1.00|XCorrection=1.00|YCorrection=1.00|PrintKind=1|BorderSize=5000000|LeftOffset=0|BottomOffset=0|Orientation=2|PaperLength=1000|PaperWidth=1000|Scale=100|PaperSource=15|PrintQuality=1200|MediaType=1|DitherType=10|PaperKind=A3|PrintScaleMode=1; Weight: -; ScaleFactor: -
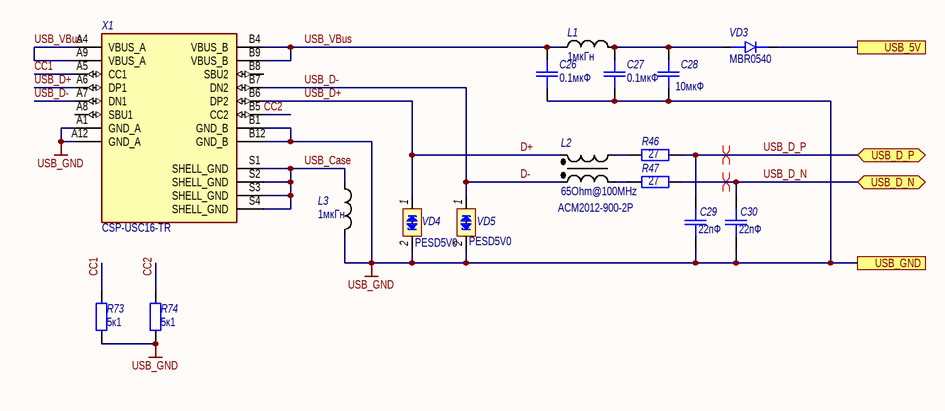
[diagram p2: nm_usb.SchDoc]

### Parts
C26  0.1мкФ  [SMD_C0603]
C27  0.1мкФ  [SMD_C0603]
C28  10мкФ  [SMD_C0603]
C29  value 22пФ  [SMD_C0603]  (hidden comment: K10-79)
C30  value 22пФ  [SMD_C0603]  (hidden comment: K10-79)
L1  value 1мкГн  [SMD_0805]  (hidden comment: Inductor)
L2  65Ohm@100MHz  Наименование: ACM2012-900-2P  [ACM2012]
L3  value 1мкГн  [SMD_0805]  (hidden comment: Inductor)
R46  value 27  [SMD_0603]  (hidden comment: OSM R1-8)
R47  value 27  [SMD_0603]  (hidden comment: OSM R1-8)
R73  value 5к1  [SMD_0603]  (hidden comment: OSM R1-8)
R74  value 5к1  [SMD_0603]  (hidden comment: OSM R1-8)
VD3  MBR0540  [SOD-123]
VD4  PESD5V0  [SOD-323]
VD5  PESD5V0  [SOD-323]
X1  CSP-USC16-TR  [VALCON_CSP-USC16-TR]

### Ports
USB_5V, USB_D_N (bidir), USB_D_P (bidir), USB_GND

### Nets
USB_GND: C26.1 C27.1 C28.1 C29.1 C30.1 L3.2 R73.2 R74.1 VD4.2(cathode_2) VD5.2(cathode_2) X1.A1(GND_A) X1.A12(GND_A) X1.B1(GND_B) X1.B12(GND_B) ; port USB_GND  [project net GND]
D+: L2.3 VD4.1(cathode_1) X1.A6(DP1) X1.B6(DP2)  [also labelled USB_D+]
D-: L2.2 VD5.1(cathode_1) X1.A7(DN1) X1.B7(DN2)  [also labelled USB_D-]
USB_5V: VD3.1(Cathode) ; port USB_5V
USB_Case: L3.1 X1.S1(SHELL_GND) X1.S2(SHELL_GND) X1.S3(SHELL_GND) X1.S4(SHELL_GND)
USB_D_N: C30.2 R47.2 ; port USB_D_N
USB_D_P: C29.2 R46.2 ; port USB_D_P
USB_VBus: C26.2 L1.1 X1.A4(VBUS_A) X1.A9(VBUS_A) X1.B4(VBUS_B) X1.B9(VBUS_B)
СС1: R73.1 X1.A5(CC1)
СС2: R74.2 X1.B5(CC2)
NetC27_2: C27.2 C28.2 L1.2 VD3.2(Anode)
NetL2_1: L2.1 R47.1
NetL2_4: L2.4 R46.1

Not connected (* = marked no-connect by the designer): X1 A8(SBU1) B8(SBU2)

### Layout directives
differential pair: USB_D_N, USB_D_P

### Notes on the sheet
- Подп. и дата
- Инв. № дубл.
- Взам. инв. №
- Инв. № подл.
- Изм.
- Лист
- № докум.
- Подп.
- Дата
- Форма 2а ГОСТ 2.104-2006
- Копировал
- Формат А4

### Library data of the parts
C26-C28 = Capacitor: as C3 on sheet nm_mcu; Place_v1: *; Place_v2: *
  C26 C27: Value: 0.1мкФ
  C28: Value: 10мкФ
C29 C30 = Capacitor: as C33 on sheet nm_main; Диэлектрик: *; Place_v1: *; Place_v2: *
L1 L3 = Inductor: as L4 on sheet nm_mcu; Place_v1: *; Place_v2: *
L2 = Inductor_coupled: Coupled inductor; Назначение: Связанная индуктивность; Потребление, Вт: 0,1; Value: 65Ohm@100MHz; Place_v1: *; Place_v2: *
R46 R47 R73 R74 = Resistor: as R88 on sheet nm_main; Place_v1: *; Place_v2: *
VD3 = MBR0540: Schottky diode; Назначение: Диод шотки; Потребление, Вт: 0,001; Наименование: MBR0540
VD4 VD5 = PESDxL1BA: Low capacitance bidirectional ESD protection diodes; Назначение: ESD защитные диоды; Потребление, Вт: 0.0; Наименование: PESD5V0S1BA; ComponentLink1Description: DataSheet; ComponentLink1URL: https://static.chipdip.ru/lib/635/DOC005635911.pdf; Place_v1: *; Place_v2: *
X1 = CSP-USC16-TR: CSP-USC16-TR Valcon USB Type C Surface Mount PCB Socket; Назначение: SMD соединитель USB type C; Потребление, Вт: 0; Package: None; Purchase-URL: https://pricing.snapeda.com/search/part/CSP-USC16-TR/?ref=eda; MP: CSP-USC16-TR; Check_prices: https://www.snapeda.com/parts/CSP-USC16-TR/Valcon/view-part/4783629/?ref=eda; MF: Valcon; Value: *; Availability: No availability data; Price: None; SnapEDA_Link: https://www.snapeda.com/parts/CSP-USC16-TR/Valcon/view-part/4783629/?ref=snap; Наименование: CSP-USC16-TR; Place_v1: *; Place_v2: *

## Sheet nm_pwr_single_ch.SchDoc: =GlobalProjectName
size 209 x 297 mm; Organization: НГУ; DocumentNumber: Э3; Revision: v1.0; SheetNumber: 4; SheetTotal: 9; PageSetup: Record=PageOptions|CenterHorizontal=True|CenterVertical=True|PrintScale=1.00|XCorrection=1.00|YCorrection=1.00|PrintKind=1|BorderSize=5000000|LeftOffset=0|BottomOffset=0|Orientation=2|PaperLength=1000|PaperWidth=1000|Scale=100|PaperSource=15|PrintQuality=1200|MediaType=1|DitherType=10|PaperKind=A3|PrintScaleMode=1; Weight: -; ScaleFactor: -
Used 5 times, as channels pwr_0, pwr_1, nm_3/nm_pwr, nm_2/nm_pwr, nm_1/nm_pwr. Parts and nets are listed once, with the designators drawn on the sheet.
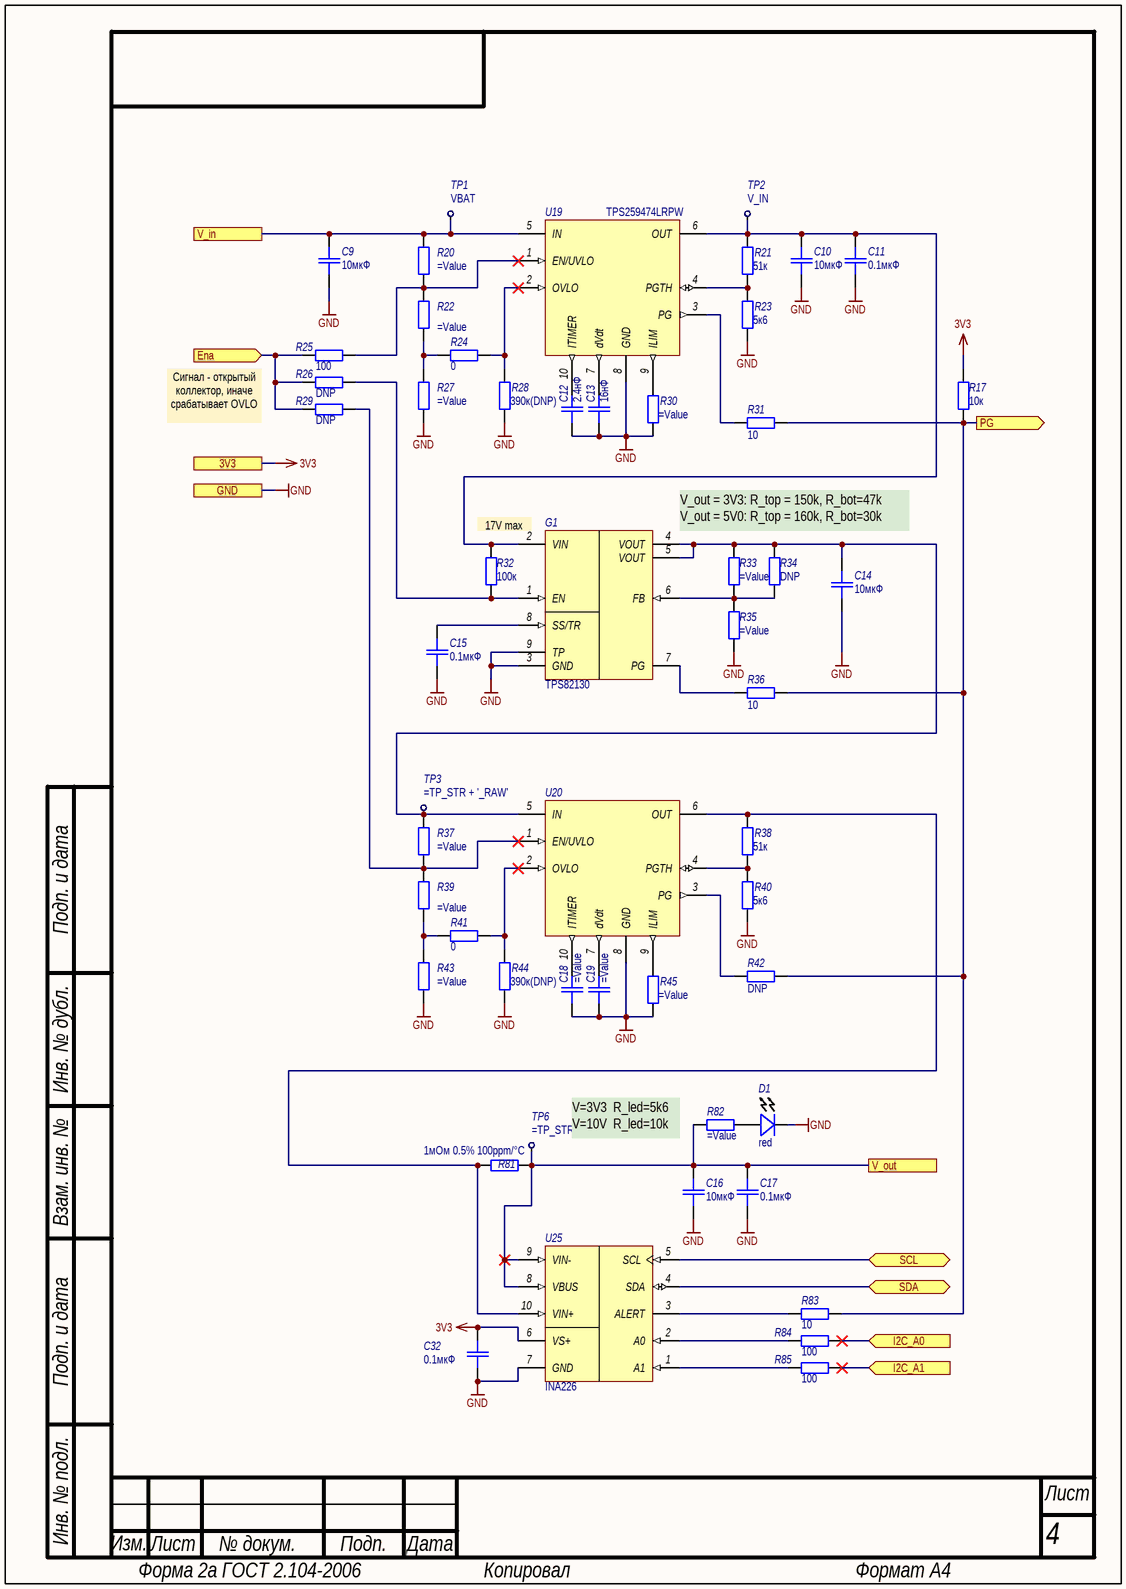
[diagram p3: nm_pwr_single_ch.SchDoc]

### Parts
C9  value 10мкФ  [SMD_C0603]  (hidden comment: Capacitor)
C10  value 10мкФ  [SMD_C0603]  (hidden comment: Capacitor)
C11  value 0.1мкФ  [SMD_C0603]  (hidden comment: Capacitor)
C12  2.4нФ  [SMD_C0603]
C13  16нФ  [SMD_C0603]
C14  value 10мкФ  [SMD_C0603]  (hidden comment: Capacitor)
C15  value 0.1мкФ  [SMD_C0603]  (hidden comment: Capacitor)
C16  value 10мкФ  [SMD_C0603]  (hidden comment: Capacitor)
C17  value 0.1мкФ  [SMD_C0603]  (hidden comment: Capacitor)
C18  (no value)  [SMD_C0603]
C19  (no value)  [SMD_C0603]
C32  0.1мкФ  [SMD_C0603]
D1  value red  [LED_0603]  (hidden comment: LED)
G1  TPS82130  [uSiL-8]
R17  10к  [SMD_0603]
R20  (no value)  [SMD_0603]
R21  51к  [SMD_0603]
R22  (no value)  [SMD_0603]
R23  5к6  [SMD_0603]
R24  0  [SMD_0603]
R25  100  [SMD_0603]
R26  value DNP  [SMD_0603]  (hidden comment: Resistor)
R27  (no value)  [SMD_0603]
R28  390к(DNP)  [SMD_0603]
R29  value DNP  [SMD_0603]  (hidden comment: Resistor)
R30  (no value)  [SMD_0603]
R31  10  [SMD_0603]
R32  value 100к  [SMD_0603]  (hidden comment: Resistor)
R33  (no value)  [SMD_0603]
R34  DNP  [SMD_0603]
R35  (no value)  [SMD_0603]
R36  10  [SMD_0603]
R37  (no value)  [SMD_0603]
R38  51к  [SMD_0603]
R39  (no value)  [SMD_0603]
R40  5к6  [SMD_0603]
R41  0  [SMD_0603]
R42  DNP  [SMD_0603]
R43  (no value)  [SMD_0603]
R44  390к(DNP)  [SMD_0603]
R45  (no value)  [SMD_0603]
R81  1мОм 0.5% 100ppm/°C  [SMD_1206]
R82  (no value)  [SMD_0603]
R83  10  [SMD_0603]
R84  100  [SMD_0603]
R85  100  [SMD_0603]
TP1  VBAT  [TP_PAD_1]  (no BOM)
TP2  V_IN  [TP_PAD_1]  (no BOM)
TP3  (no value)  [TP_PAD_1]  (no BOM)
TP6  (no value)  [TP_PAD_1]  (no BOM)
U19  Наименование: TPS259474LRPW  [VQFN-HR-10]  (hidden comment: TPS25947x)
U20  TPS25947x  [VQFN-HR-10]  (value not drawn)
U25  INA226  [VSSOP-10]

### Ports
3V3, Ena (in), GND, I2C_A0 (in), I2C_A1 (in), PG (out), SCL (bidir), SDA (bidir), V_in, V_out

### Nets
3V3: C32.2 R17.2 U25.6(VS+) ; port 3V3
GND: C9.1 C10.1 C11.1 C12.1 C13.1 C14.1 C15.1 C16.1 C17.1 C18.1 C19.1 C32.1 D1.2(K) G1.3(GND) G1.9(TP) R23.1 R27.1 R28.1 R30.1 R35.2 R40.1 R43.1 R44.1 R45.1 U19.8(GND) U20.8(GND) U25.7(GND) ; port GND
Ena: R25.2 R26.2 R29.2 ; port Ena
I2C_A0: R84.1 ; port I2C_A0
I2C_A1: R85.1 ; port I2C_A1
PG: R17.1 R31.1 R36.1 R42.1 R83.1 ; port PG
SCL: U25.5(SCL) ; port SCL
SDA: U25.4(SDA) ; port SDA
V_in: C9.2 R20.2 TP1.0(TP) U19.5(IN) ; port V_in
V_out: C16.2 C17.2 R81.1 R82.1 TP6.0(TP) U25.8(VBUS) U25.9(VIN-) ; port V_out
NetC10_2: C10.2 C11.2 G1.2(VIN) R21.2 R32.1 TP2.0(TP) U19.6(OUT)
NetC12_2: C12.2 U19.10(ITIMER)
NetC13_2: C13.2 U19.7(dVdt)
NetC14_2: C14.2 G1.4(VOUT) G1.5(VOUT) R33.1 R34.1 R37.2 TP3.0(TP) U20.5(IN)
NetC15_2: C15.2 G1.8(SS/TR)
NetC18_2: C18.2 U20.10(ITIMER)
NetC19_2: C19.2 U20.7(dVdt)
NetD1_1: D1.1(A) R82.2
NetG1_1: G1.1(EN) R26.1 R32.2
NetG1_6: G1.6(FB) R33.2 R34.2 R35.1
NetG1_7: G1.7(PG) R36.2
NetR20_1: R20.1 R22.2 R25.1 U19.1(EN/UVLO)
NetR21_1: R21.1 R23.2 U19.4(PGTH)
NetR22_1: R22.1 R24.2 R27.2
NetR24_1: R24.1 R28.2 U19.2(OVLO)
NetR29_1: R29.1 R37.1 R39.2 U20.1(EN/UVLO)
NetR30_2: R30.2 U19.9(ILIM)
NetR31_2: R31.2 U19.3(PG)
NetR38_1: R38.1 R40.2 U20.4(PGTH)
NetR38_2: R38.2 R81.2 U20.6(OUT) U25.10(VIN+)
NetR39_1: R39.1 R41.2 R43.2
NetR41_1: R41.1 R44.2 U20.2(OVLO)
NetR42_2: R42.2 U20.3(PG)
NetR45_2: R45.2 U20.9(ILIM)
NetR83_2: R83.2 U25.3(ALERT)
NetR84_2: R84.2 U25.2(A0)
NetR85_2: R85.2 U25.1(A1)

### Channels
pwr_0: designators end in _1; ports 3V3=3V3 Ena=Ena_pwr_0 GND=GND I2C_A0=GND I2C_A1=GND PG=3V3_PG SCL=SCL SDA=SDA V_in=VBAT V_out=V_out
pwr_1: designators end in _2; ports 3V3=3V3 Ena=Ena_pwr_1 GND=GND I2C_A0=3V3 I2C_A1=3V3 PG=5V_PG SCL=SCL SDA=SDA V_in=VBAT V_out=3V3
nm_3/nm_pwr: designators end in _3; ports 3V3=3V3 Ena=nm_bus3.Ena GND=GND I2C_A0=SCL I2C_A1=GND PG=NM3_PG SCL=SCL SDA=SDA V_in=VBAT V_out=VBUS
nm_2/nm_pwr: designators end in _4; ports 3V3=3V3 Ena=nm_bus2.Ena GND=GND I2C_A0=SDA I2C_A1=GND PG=NM2_PG SCL=SCL SDA=SDA V_in=VBAT V_out=VBUS
nm_1/nm_pwr: designators end in _5; ports 3V3=3V3 Ena=nm_bus1.Ena GND=GND I2C_A0=3V3 I2C_A1=GND PG=NM1_PG SCL=SCL SDA=SDA V_in=VBAT V_out=VBUS

### Notes on the sheet
- Сигнал - открытый коллектор, иначе срабатывает OVLO
- 17V max
- V_out = 3V3: R_top = 150k, R_bot=47k
  V_out = 5V0: R_top = 160k, R_bot=30k
- V=3V3  R_led=5k6
  V=10V  R_led=10k
- Подп. и дата
- Инв. № дубл.
- Взам. инв. №
- Инв. № подл.
- Изм.
- Лист
- № докум.
- Подп.
- Дата
- Форма 2а ГОСТ 2.104-2006
- Копировал
- Формат А4

### Library data of the parts
C9-C19 = Capacitor: as C33 on sheet nm_main; Диэлектрик: *; Place_v1: *; Place_v2: *
  C12: Value: 2.4нФ
  C13: Value: 16нФ
  C18: Value: =C_efuse2_itimer
  C19: Value: =C_efuse2_dVdT
C32 = Capacitor: as C3 on sheet nm_mcu; Value: 0.1мкФ; Place_v1: *; Place_v2: *
D1 = LED: as D2 on sheet nm_main; Place_v1: *; Place_v2: *
G1 = TPS82130: 17-V Input 3-A Step-Down Converter MicroSiP™ Module with Integrated Inductor; Потребление, Вт: 1,0; ComponentLink1Description: Data sheet; ComponentLink1URL: http://www.ti.com/lit/ds/symlink/tps82130.pdf; Назначение: 17-V Input 3-A Step-Down Converter MicroSiP™ Module with Integrated Inductor; DataSheet: https://www.ti.com/lit/ds/symlink/tps82130.pdf?ts=1592813288219&ref_url=https%253A%252F%252Fwww.google.com%252F; Supplier 1: Digi-Key; Supplier Part Number 1: 296-43922-1-ND; Наименование: TPS82130; Place_v1: =PL_V_REG_PLACE; Place_v2: =PL_V_REG_PLACE
R17 = Resistor: as R4 on sheet nm_main; Value: 10к; Place_v1: *; Place_v2: *
R20-R25 R27 R28 R30 R31 R33-R44 R82-R85 = Resistor: as R1 on sheet nm_main; Place_v1: *; Place_v2: *
  R20: Value: =R_efuse1_top
  R21 R38: Value: 51к
  R22: Value: =R_efuse1_mid
  R23 R40: Value: 5к6
  R24 R41: Value: 0
  R25 R84 R85: Value: 100
  R27: Value: =R_efuse1_bot
  R28 R44: Value: 390к(DNP)
  R30: Value: =R_efuse1_ilim
  R31 R36 R83: Value: 10
  R33: Value: =R1_Value
  R34 R42: Value: DNP
  R35: Value: =R2_Value
  R37: Value: =R_efuse2_top
  R39: Value: =R_efuse2_mid
  R43: Value: =R_efuse2_bot
  R82: Value: =R_pwr_led
R26 R29 R32 = Resistor: as R88 on sheet nm_main; Place_v1: *; Place_v2: *
R45 = Resistor: Назначение: SMD-резистор; Потребление, Вт: 0,001; Value: =R_efuse2_ilim; Place_v1: *; Place_v2: *
R81 = Resistor: PE1206DRM470R01L; Наименование: Резистор; Назначение: SMD-резистор; Потребление, Вт: 0,001; Value: 1мОм 0.5% 100ppm/°C; Place_v1: *; Place_v2: *
TP1-TP3 TP6 = TP: as TP4 on sheet nm_main; Place_v1: *; Place_v2: *
  TP1: TP_Name: VBAT
  TP2: TP_Name: V_IN
  TP3: TP_Name: =TP_STR + '_RAW'
  TP6: TP_Name: =TP_STR + '_OUT'
U19 = TPS25947x: TPS25947xx, 2.7 - 23 V, 5.5 A, 28-mΩ True Reverse Current Blocking eFuse with Input / Reverse Polarity Protection; Потребление, Вт: 0,05; Назначение: 2.7 - 23 V, 5.5 A, 28-mΩ True Reverse Current Blocking eFuse with Input; ComponentLink1Description: DataSheet; ComponentLink1URL: https://www.ti.com/lit/ds/symlink/tps25947.pdf?ts=1621925066842&ref_url=https%253A%252F%252Fwww.ti.com%252Fproduct%252FTPS25947%253FkeyMatch%253DTPS25947%2526tisearch%253Dsearch-everything%2526usecase%253DGPN; Place_v1: =PL_E_Fuse_PLACE; Place_v2: =PL_E_Fuse_PLACE
U20 = TPS25947x: TPS25947xx, 2.7 - 23 V, 5.5 A, 28-mΩ True Reverse Current Blocking eFuse with Input / Reverse Polarity Protection; Наименование: TPS259474LRPW; Потребление, Вт: 0,05; Назначение: 2.7 - 23 V, 5.5 A, 28-mΩ True Reverse Current Blocking eFuse with Input; ComponentLink1Description: DataSheet; ComponentLink1URL: https://www.ti.com/lit/ds/symlink/tps25947.pdf?ts=1621925066842&ref_url=https%253A%252F%252Fwww.ti.com%252Fproduct%252FTPS25947%253FkeyMatch%253DTPS25947%2526tisearch%253Dsearch-everything%2526usecase%253DGPN; Place_v1: =PL_E_Fuse_PLACE; Place_v2: =PL_E_Fuse_PLACE
U25 = INA226: High- or Low-Side Measurement, Bidirectional Current and Power Monitor With I2C Interface; Назначение: High-Side or Low-Side Measurement,; Потребление, Вт: 0,001; ComponentLink1Description: Data sheet; ComponentLink1URL: http://www.ti.com/lit/ds/symlink/ina226.pdf; DataSheet: https://www.ti.com/lit/ds/symlink/ina226.pdf?ts=1592809211957&ref_url=https%253A%252F%252Fwww.google.com%252F; Наименование: INA226; Place_v1: =PL_E_Fuse_PLACE; Place_v2: =PL_E_Fuse_PLACE

## Sheet nm_mem.SchDoc: =GlobalProjectName
size 209 x 297 mm; Organization: НГУ; DocumentNumber: Э3; Revision: v1.0; SheetNumber: 5; SheetTotal: 9; PageSetup: Record=PageOptions|CenterHorizontal=True|CenterVertical=True|PrintScale=1.00|XCorrection=1.00|YCorrection=1.00|PrintKind=1|BorderSize=5000000|LeftOffset=0|BottomOffset=0|Orientation=2|PaperLength=1000|PaperWidth=1000|Scale=100|PaperSource=15|PrintQuality=1200|MediaType=1|DitherType=10|PaperKind=A3|PrintScaleMode=1; Weight: -; ScaleFactor: -
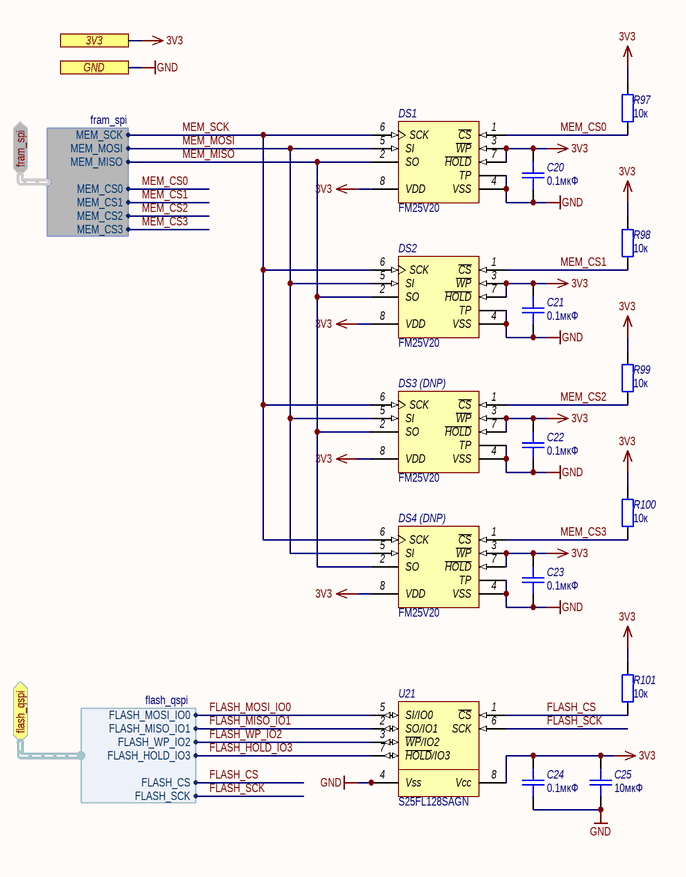
[diagram p4: nm_mem.SchDoc]

### Parts
C20  0.1мкФ  [SMD_C0603]
C21  0.1мкФ  [SMD_C0603]
C22  0.1мкФ  [SMD_C0603]
C23  0.1мкФ  [SMD_C0603]
C24  0.1мкФ  [SMD_C0603]
C25  10мкФ  [SMD_C0603]
DS1  FM25V20  [TDFN-8_6x5]
DS2  FM25V20  [TDFN-8_6x5]
DS3_(DNP)  FM25V20  [TDFN-8_6x5]
DS4_(DNP)  FM25V20  [TDFN-8_6x5]
R97  value 10к  [SMD_0603]  (hidden comment: Resistor)
R98  value 10к  [SMD_0603]  (hidden comment: Resistor)
R99  value 10к  [SMD_0603]  (hidden comment: Resistor)
R100  value 10к  [SMD_0603]  (hidden comment: Resistor)
R101  value 10к  [SMD_0603]  (hidden comment: Resistor)
U21  S25FL128SAGN  [WSON-8_6x8]

### Ports
3V3, flash_qspi (bidir, harness flash_qspi), fram_spi (bidir, harness fram_spi), GND

### Harnesses
fram_spi: MEM_SCK, MEM_MOSI, MEM_MISO, MEM_CS0, MEM_CS1, MEM_CS2, MEM_CS3
flash_qspi: FLASH_MOSI_IO0, FLASH_MISO_IO1, FLASH_WP_IO2, FLASH_HOLD_IO3, FLASH_CS, FLASH_SCK

### Nets
3V3: C20.2 C21.2 C22.2 C23.2 C24.2 C25.2 DS1.3(~{WP}) DS1.7(~{HOLD}) DS1.8(VDD) DS2.3(~{WP}) DS2.7(~{HOLD}) DS2.8(VDD) DS3_(DNP).3(~{WP}) DS3_(DNP).7(~{HOLD}) DS3_(DNP).8(VDD) DS4_(DNP).3(~{WP}) DS4_(DNP).7(~{HOLD}) DS4_(DNP).8(VDD) R97.1 R98.1 R99.1 R100.1 R101.1 U21.8(Vcc) ; port 3V3
GND: C20.1 C21.1 C22.1 C23.1 C24.1 C25.1 DS1.4(VSS) DS1.TP DS2.4(VSS) DS2.TP DS3_(DNP).4(VSS) DS3_(DNP).TP DS4_(DNP).4(VSS) DS4_(DNP).TP U21.4(Vss) U21.9(TP) ; port GND
FLASH_CS: R101.2 U21.1(~{CS}) ; port flash_qspi.FLASH_CS
FLASH_HOLD_IO3: U21.7(~{HOLD}/IO3) ; port flash_qspi.FLASH_HOLD_IO3
FLASH_MISO_IO1: U21.2(SO/IO1) ; port flash_qspi.FLASH_MISO_IO1
FLASH_MOSI_IO0: U21.5(SI/IO0) ; port flash_qspi.FLASH_MOSI_IO0
FLASH_SCK: U21.6(SCK) ; port flash_qspi.FLASH_SCK
FLASH_WP_IO2: U21.3(~{WP}/IO2) ; port flash_qspi.FLASH_WP_IO2
MEM_CS0: DS1.1(~{CS}) R97.2 ; port fram_spi.MEM_CS0
MEM_CS1: DS2.1(~{CS}) R98.2 ; port fram_spi.MEM_CS1
MEM_CS2: DS3_(DNP).1(~{CS}) R99.2 ; port fram_spi.MEM_CS2
MEM_CS3: DS4_(DNP).1(~{CS}) R100.2 ; port fram_spi.MEM_CS3
MEM_MISO: DS1.2(SO) DS2.2(SO) DS3_(DNP).2(SO) DS4_(DNP).2(SO) ; port fram_spi.MEM_MISO
MEM_MOSI: DS1.5(SI) DS2.5(SI) DS3_(DNP).5(SI) DS4_(DNP).5(SI) ; port fram_spi.MEM_MOSI
MEM_SCK: DS1.6(SCK) DS2.6(SCK) DS3_(DNP).6(SCK) DS4_(DNP).6(SCK) ; port fram_spi.MEM_SCK

### Notes on the sheet
- Подп. и дата
- Инв. № дубл.
- Взам. инв. №
- Инв. № подл.
- Изм.
- Лист
- № докум.
- Подп.
- Дата
- Форма 2а ГОСТ 2.104-2006
- Копировал
- Формат А4

### Library data of the parts
C20-C25 = Capacitor: as C3 on sheet nm_mcu; Place_v1: *; Place_v2: *
  C20-C24: Value: 0.1мкФ
  C25: Value: 10мкФ
DS1 DS2 DS3_(DNP) DS4_(DNP) = FM25V: 2Mb Serial 3V FRAM Memory; Потребление, Вт: 0,009; Назначение: 2Mb Serial 3V FRAM Memory; ComponentLink1Description: Datasheet; ComponentLink1URL: https://www.cypress.com/file/136456/download; Наименование: FM25V20; Place_v1: *; Place_v2: *
R97-R101 = Resistor: as R88 on sheet nm_main; Place_v1: *; Place_v2: *
U21 = S25FL128SAGN: Programmable NOR flash memory; Потребление, Вт: 0.1; Назначение: Programmable NOR flash memory; ComponentLink1Description: DataSheet; ComponentLink1URL: https://www.infinite-electronic.ru/datasheet/8b-S25FL256SAGBHV203.pdf; Supplier 1: Digi-Key; Supplier Part Number 1: 428-4618-ND; Наименование: S25FL128SAGN; Place_v1: *; Place_v2: *

## Sheet nm_sys_can_phy.SchDoc
size 209 x 297 mm; SheetNumber: 7; SheetTotal: 9
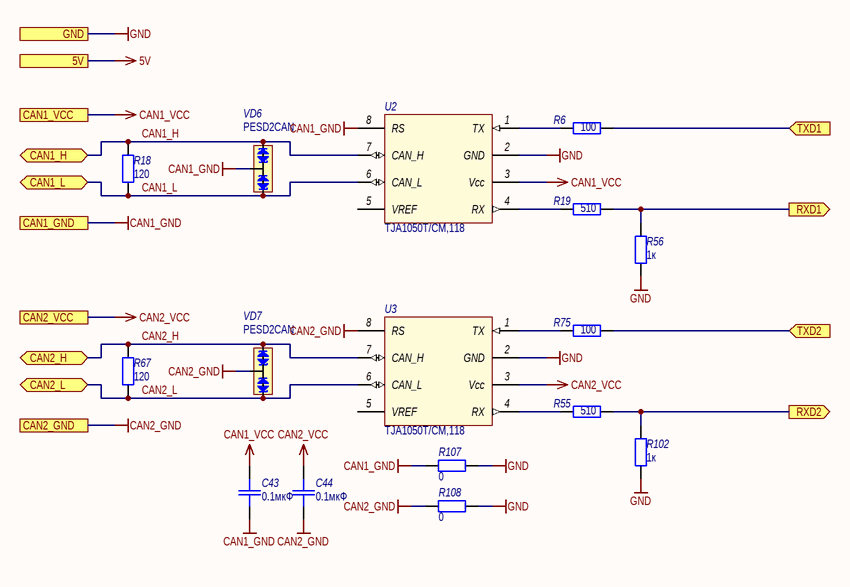
[diagram p5: nm_sys_can_phy.SchDoc]

### Parts
C43  0.1мкФ  [SMD_C0603]
C44  0.1мкФ  [SMD_C0603]
R6  value 100  [SMD_0603]  (hidden comment: Resistor)
R18  value 120  [SMD_0603]  (hidden comment: Resistor)
R19  value 510  [SMD_0603]  (hidden comment: Resistor)
R55  value 510  [SMD_0603]  (hidden comment: Resistor)
R56  value 1к  [SMD_0603]  (hidden comment: Resistor)
R67  value 120  [SMD_0603]  (hidden comment: Resistor)
R75  value 100  [SMD_0603]  (hidden comment: Resistor)
R102  value 1к  [SMD_0603]  (hidden comment: Resistor)
R107  value 0  [SMD_0603]  (hidden comment: Resistor)
R108  value 0  [SMD_0603]  (hidden comment: Resistor)
U2  Наименование: TJA1050T/CM,118  [SOIC-8]  (hidden comment: TJA1050)
U3  Наименование: TJA1050T/CM,118  [SOIC-8]  (hidden comment: TJA1050)
VD6  PESD2CAN  [SOT-23]
VD7  PESD2CAN  [SOT-23]

### Ports
5V, CAN1_GND, CAN1_H (bidir), CAN1_L (bidir), CAN1_VCC, CAN2_GND, CAN2_H (bidir), CAN2_L (bidir), CAN2_VCC, GND, RXD1 (out), RXD2 (out), TXD1 (in), TXD2 (in)

### Nets
CAN1_GND: C43.1 R107.2 U2.8(RS) VD6.3(CC) ; port CAN1_GND
CAN1_VCC: C43.2 U2.3(Vcc) ; port CAN1_VCC
CAN2_GND: C44.1 R108.2 U3.8(RS) VD7.3(CC) ; port CAN2_GND
CAN2_VCC: C44.2 U3.3(Vcc) ; port CAN2_VCC
GND: R56.1 R102.1 R107.1 R108.1 U2.2(GND) U3.2(GND) ; port GND
CAN1_H: R18.2 U2.7(CAN_H) VD6.2(C2) ; port CAN1_H
CAN1_L: R18.1 U2.6(CAN_L) VD6.1(C1) ; port CAN1_L
CAN2_H: R67.2 U3.7(CAN_H) VD7.2(C2) ; port CAN2_H
CAN2_L: R67.1 U3.6(CAN_L) VD7.1(C1) ; port CAN2_L
CAN_RX1: R19.2 R56.2 ; port RXD1
CAN_RX2: R55.2 R102.2 ; port RXD2
CAN_TX1: R6.2 ; port TXD1
CAN_TX2: R75.2 ; port TXD2
NetR6_1: R6.1 U2.1(TX)
NetR19_1: R19.1 U2.4(RX)
NetR55_1: R55.1 U3.4(RX)
NetR75_1: R75.1 U3.1(TX)

Not connected (* = marked no-connect by the designer): U2 5(VREF); U3 5(VREF)

### Notes on the sheet
- Подп. и дата
- Инв. № дубл.
- Взам. инв. №
- Инв. № подл.
- Изм.
- Лист
- № докум.
- Подп.
- Дата
- Форма 2а ГОСТ 2.104-2006
- Копировал
- Формат А4

### Library data of the parts
C43 C44 = Capacitor: as C33 on sheet nm_main; Value: 0.1мкФ; Диэлектрик: *; Place_v1: *; Place_v2: *
R6 R18 R19 R55 R56 R67 R75 R102 R107 R108 = Resistor: as R88 on sheet nm_main
  R6 R18 R19 R55 R56 R67 R75 R102: Place_v1: *; Place_v2: *
U2 U3 = TJA1050: Isolated CAN Transceiver; Назначение: CAN приемник; Потребление, Вт: 0,001; ComponentLink1Description: Datasheet; ComponentLink1URL: https://static.chipdip.ru/lib/205/DOC000205042.pdf; Place_v1: *; Place_v2: *
VD6 VD7 = PESD2CAN: CAN bus ESD protection diode; Назначение: Защитная диодная сборка CAN-шины от ЭСР; Потребление, Вт: 0,001; ComponentLink1Description: DataSheet; ComponentLink1URL: https://docviewer.yandex.ru/view/20572601/?*=RQqn8Wj9g8uNyA%2Fh5vLXNATrwhl7InVybCI6Imh0dHBzOi8vYXNzZXRzLm5leHBlcmlhLmNvbS9kb2N1bWVudHMvZGF0YS1zaGVldC9QRVNEMkNBTi5wZGYiLCJ0aXRsZSI6IlBFU0QyQ0FOLnBkZiIsIm5vaWZyYW1lIjp0cnVlLCJ1aWQiOiIyMDU3MjYwMSIsInRzIjoxNTk2Nzk0OTE4Njc4LCJ5dSI6Ijg4OTA2MTMzMTU0MzM4NzEyMSIsInNlcnBQYXJhbXMiOiJsYW5nPWVuJnRtPTE1OTY3OTQ4OTAmdGxkPXJ1Jm5hbWU9UEVTRDJDQU4ucGRmJnRleHQ9cGVzZDJjYW4mdXJsPWh0dHBzJTNBLy9hc3NldHMubmV4cGVyaWEuY29tL2RvY3VtZW50cy9kYXRhLXNoZWV0L1BFU0QyQ0FOLnBkZiZscj02NSZtaW1lPXBkZiZsMTBuPXJ1JnNpZ249MzE3ZjE4NzU1MTcwMWNmYmI4ZDQxYzc2OTNlYTFkYzIma2V5bm89MCJ9&lang=en; Наименование: PESD2CAN; Place_v1: *; Place_v2: *

## Sheet nm_npu_proc.SchDoc
size 209 x 297 mm; SheetNumber: 8; SheetTotal: 9
Used 3 times, as channels nm_3, nm_2, nm_1. Parts and nets are listed once, with the designators drawn on the sheet.
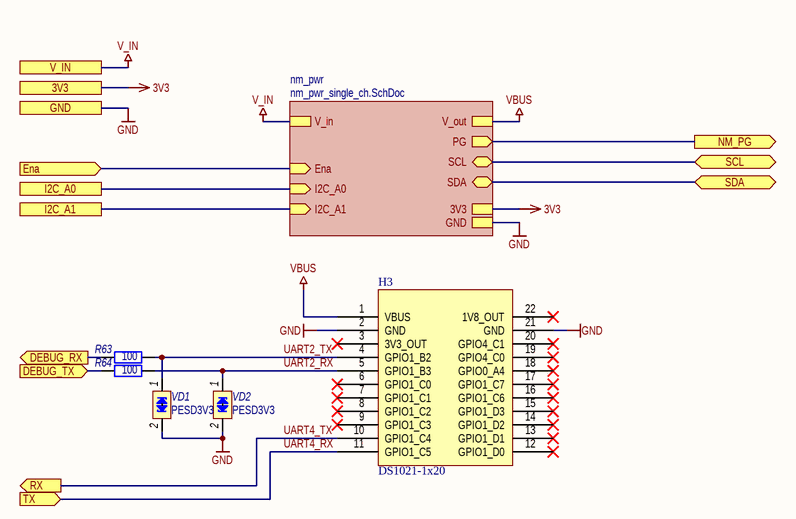
[diagram p6: nm_npu_proc.SchDoc]

### Parts
H3  DS1021-1x20  [DS1021-1x20]
R63  value 100  [SMD_0603]  (hidden comment: Resistor)
R64  value 100  [SMD_0603]  (hidden comment: Resistor)
VD1  PESD3V3  [SOD-323]
VD2  PESD3V3  [SOD-323]

### Sub-sheets
nm_pwr = nm_pwr_single_ch.SchDoc: Ena (in), V_in, PG (out), GND, SCL (bidir), SDA (bidir), I2C_A0 (in), I2C_A1 (in), 3V3, V_out  | TP_STR: 5V0; R1_Value: 160k; R2_Value: 30k; R_efuse1_mid: 120k; R_efuse1_bot: 43k; R_efuse1_ilim: 3k3; R_pwr_led: 4k7; R_efuse2_bot: 130k; R_efuse2_mid: 62k; R_efuse2_ilim: 3k3; R_efuse1_top: 470k; R_efuse2_top: 470k; C_efuse2_dVdT: 10нФ; C_efuse2_itimer: 2.4нФ

### Ports
3V3, DEBUG_RX (out), DEBUG_TX (in), Ena (in), GND, I2C_A0, I2C_A1, NM_PG (out), RX (out), SCL (bidir), SDA (bidir), TX (in), V_IN

### Nets
3V3: port 3V3, sheet nm_pwr/3V3
GND: H3.2(GND) H3.21(GND) VD1.2(cathode_2) VD2.2(cathode_2) ; port GND, sheet nm_pwr/GND
V_IN: port V_IN, sheet nm_pwr/V_in
VBUS: H3.1(VBUS) ; sheet nm_pwr/V_out
DEBUG_RX: R63.1 ; port DEBUG_RX
DEBUG_TX: R64.1 ; port DEBUG_TX
Ena: port Ena, sheet nm_pwr/Ena
I2C_A0: port I2C_A0, sheet nm_pwr/I2C_A0
I2C_A1: port I2C_A1, sheet nm_pwr/I2C_A1
NM_PG: port NM_PG, sheet nm_pwr/PG
SCL: port SCL, sheet nm_pwr/SCL
SDA: port SDA, sheet nm_pwr/SDA
UART2_RX: H3.5(GPIO1_B3) R64.2 VD2.1(cathode_1)
UART2_TX: H3.4(GPIO1_B2) R63.2 VD1.1(cathode_1)
UART4_RX: H3.11(GPIO1_C5) ; port TX
UART4_TX: H3.10(GPIO1_C4) ; port RX

Not connected (* = marked no-connect by the designer): H3 3(3V3_OUT)* 6(GPIO1_C0)* 7(GPIO1_C1)* 8(GPIO1_C2)* 9(GPIO1_C3)* 12(GPIO1_D0)* 13(GPIO1_D1)* 14(GPIO1_D2)* 15(GPIO1_D3)* 16(GPIO1_C6)* 17(GPIO1_C7)* 18(GPIO0_A4)* 19(GPIO4_C0)* 20(GPIO4_C1)* 22(1V8_OUT)*

### Channels
nm_3: designators end in _1; ports 3V3=3V3 DEBUG_RX=DEBUG_RX DEBUG_TX=DEBUG_TX Ena=nm_bus3.Ena GND=GND I2C_A0=SCL I2C_A1=GND NM_PG=NM3_PG RX=nm_bus3.RX SCL=SCL SDA=SDA TX=nm_bus3.TX V_IN=VBAT
nm_2: designators end in _2; ports 3V3=3V3 DEBUG_RX=DEBUG_RX DEBUG_TX=DEBUG_TX Ena=nm_bus2.Ena GND=GND I2C_A0=SDA I2C_A1=GND NM_PG=NM2_PG RX=nm_bus2.RX SCL=SCL SDA=SDA TX=nm_bus2.TX V_IN=VBAT
nm_1: designators end in _3; ports 3V3=3V3 DEBUG_RX=DEBUG_RX DEBUG_TX=DEBUG_TX Ena=nm_bus1.Ena GND=GND I2C_A0=3V3 I2C_A1=GND NM_PG=NM1_PG RX=nm_bus1.RX SCL=SCL SDA=SDA TX=nm_bus1.TX V_IN=VBAT

### Notes on the sheet
- Подп. и дата
- Инв. № дубл.
- Взам. инв. №
- Инв. № подл.
- Изм.
- Лист
- № докум.
- Подп.
- Дата
- Форма 2а ГОСТ 2.104-2006
- Копировал
- Формат А4

### Library data of the parts
R63 R64 = Resistor: as R88 on sheet nm_main; Place_v1: *; Place_v2: *
VD1 VD2 = PESDxL1BA: Low capacitance bidirectional ESD protection diodes; Назначение: ESD защитные диоды; Потребление, Вт: 0.0; Наименование: PESDxL1BA; ComponentLink1Description: DataSheet; ComponentLink1URL: https://static.chipdip.ru/lib/635/DOC005635911.pdf